# Altium project B001AA.PrjPcb (part 2 of 3)

## Sheet Buzzer.SchDoc: Piezzo Buzzer & Audio Amplifier
size 292 x 193 mm; DocumentNumber: 25; SheetNumber: 18; SheetTotal: 28
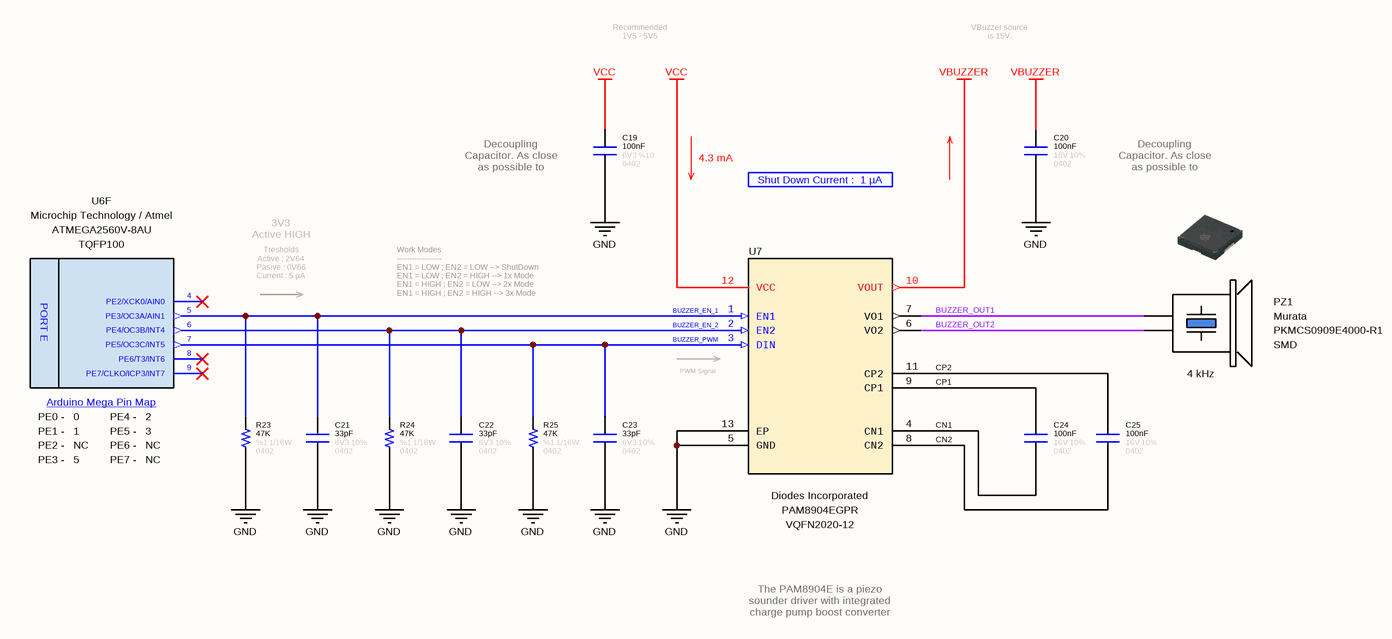
[diagram p13: Buzzer.SchDoc]

### Parts
C19  value 100nF  Tolerance: %10  Voltage: 6V3  Case: 0402  [CAPACITOR_0402]  (hidden comment: Capacitor - 100nF [0402] (Ceramic))
C20  value 100nF  Tolerance: 10%  Case: 0402  Voltage: 16V  [CAPACITOR_0402]  (hidden comment: Capacitor - 100nF [0402] (Ceramic))
C21  value 33pF  Tolerance: 10%  Case: 0402  Voltage: 6V3  [CAPACITOR_0402]  (hidden comment: Capacitor - 33pF [0402] (Ceramic))
C22  value 33pF  Tolerance: 10%  Case: 0402  Voltage: 6V3  [CAPACITOR_0402]  (hidden comment: Capacitor - 33pF [0402] (Ceramic))
C23  value 33pF  Tolerance: 10%  Case: 0402  Voltage: 6V3  [CAPACITOR_0402]  (hidden comment: Capacitor - 33pF [0402] (Ceramic))
C24  value 100nF  Tolerance: 10%  Case: 0402  Voltage: 16V  [CAPACITOR_0402]  (hidden comment: Capacitor - 100nF [0402] (Ceramic))
C25  value 100nF  Tolerance: 10%  Case: 0402  Voltage: 16V  [CAPACITOR_0402]  (hidden comment: Capacitor - 100nF [0402] (Ceramic))
PZ1  Manufacturer Name: Murata  Case: SMD  Frequency: 4 kHz  [Murata - Buzzer]  (hidden comment: PKMCS0909E4000-R1)
R23  value 47K  Tolerance: %1  Case: 0402  Power: 1/16W  [RESISTOR_0402]  (hidden comment: 47K - 0402 - %1 - 1/16W)
R24  value 47K  Tolerance: %1  Case: 0402  Power: 1/16W  [RESISTOR_0402]  (hidden comment: 47K - 0402 - %1 - 1/16W)
R25  value 47K  Tolerance: %1  Case: 0402  Power: 1/16W  [RESISTOR_0402]  (hidden comment: 47K - 0402 - %1 - 1/16W)
U6  Manufacturer Name: Microchip Technology / Atmel  Case: TQFP100  [TQFP-100]  (hidden comment: ATMEGA2560V-8AU)  (part F of 16)
U7  Manufacturer Name: Diodes Incorporated  Case: VQFN2020-12  [U-QFN2020-12]  (hidden comment: PAM8904EGPR)

### Nets
GND: C19.1 C20.1 C21.1 C22.1 C23.1 R23.1 R24.1 R25.1 U7.5(GND) U7.13(EP)
VBUZZER: C20.2 U7.10(VOUT)
VCC: C19.2 U7.12(VCC)
BUZZER_EN_1: C21.2 R23.2 U6.5(PE3/OC3A/AIN1) U7.1(EN1)
BUZZER_EN_2: C22.2 R24.2 U6.6(PE4/OC3B/INT4) U7.2(EN2)
BUZZER_OUT1: PZ1.1(+) U7.7(VO1)
BUZZER_OUT2: PZ1.2(-) U7.6(VO2)
BUZZER_PWM: C23.2 R25.2 U6.7(PE5/OC3C/INT5) U7.3(DIN)
CN1: C24.1 U7.4(CN1)
CN2: C25.1 U7.8(CN2)
CP1: C24.2 U7.9(CP1)
CP2: C25.2 U7.11(CP2)

Not connected (* = marked no-connect by the designer): U6 4(PE2/XCK0/AIN0)* 8(PE6/T3/INT6)* 9(PE7/CLKO/ICP3/INT7)*

### Notes on the sheet
- Recommended 1V5 - 5V5
- VBuzzer source is 15V.
- (near C19) Decoupling Capacitor. As close as possible to PAM8904 pin-12.
- 4.3 mA
- Shut Down Current :  1 µA
- Decoupling Capacitor. As close as possible to PAM8904 pin-10.
- 3V3
  Active HIGH
- Tresholds
  Active : 2V64
  Pasive : 0V66
  Current : 5 µA
- Work Modes
  ------------------
  EN1 = LOW ; EN2 = LOW --> ShutDown
  EN1 = LOW ; EN2 = HIGH --> 1x Mode
  EN1 = HIGH ; EN2 = LOW --> 2x Mode
  EN1 = HIGH ; EN2 = HIGH --> 3x Mode
- (near U7) PWM Signal
- The PAM8904E is a piezo sounder driver with integrated charge pump boost converter
- © 2021 All rights reserved.
  This document may not, in whole or in part, be copied, photocopied, reproduced, translated or converted to any electronic or machine readable from without prior written permission of Mehmet Günce Akkoyun.
  Engineer contact : akkoyun@me.com
- Property of
- Engineer :
- Date :
- Size :
- A4
- Time :
- Project :
- Page :
- /
- Customer :
- Product ID :
- Module ID :
- Version :
- File :
- Revision :
- (in symbol IC - AtMega2560V-8AU, part F) PORT E; Arduino Mega Pin Map; PE0 -; 0; PE4 -; PE1 -; PE5 -; PE2 -; NC; PE6 -; PE3 -; PE7 -

### Library data of the parts
C19 = Capacitor - 100nF [0402-6V3]: as C8 on sheet FOTA Microcontroller Power Switch; ComponentLink1Description: Mouser; ComponentLink1URL: https://www.mouser.com.tr/ProductDetail/AVX/04026D104KAT4A?qs=sGAEpiMZZMs0AnBnWHyRQPg4iYkCw7IMED%2F4kpqgf7w%3D; ComponentLink2Description: DataSheet; ComponentLink2URL: https://www.mouser.com.tr/datasheet/2/40/cx5r-776519.pdf
C20 C24 C25 = Capacitor - 100nF [0402-16V]: Multilayer Ceramic Capacitors - SMD - 16V 100nF X7R 0402 10%; Manufacturer Name: AVX; Manufacturer Part Number: 0402YC104KAT2A
C21-C23 = Capacitor - 33pF [0402-6V3]: as C72 on sheet Port L Output Port; ComponentLink1Description: DataSheet; ComponentLink1URL: https://api.kemet.com/component-edge/download/datasheet/C0402C330J9RACAUTO.pdf; ComponentLink2Description: Mouser; ComponentLink2URL: https://www.mouser.com/Search/Refine.aspx?Keyword=80-C0402C330J9RAUTO
PZ1 = Buzzer - PKMCS0909E4000-R1: MURATA - PKMCS0909E4000-R1 - Transducer, Piezo, Sounder, Sounder, -12.5 VDC, 12.5 VDC, 65 dB; Sound Pressure Level: 65 dBA; Voltage Rating: 12.5 V; Product Type: Piezo Buzzers; RoHS: Yes; Manufacturer Part Number: PKMCS0909E4000-R1
R23-R25 = Resistor - 47K [0402]: as R8 on sheet FOTA LED Driver; ComponentLink1Description: DataSheet; ComponentLink1URL: https://www.mouser.com.tr/datasheet/2/427/dcrcwe3-1762152.pdf; ComponentLink2Description: Mouser; ComponentLink2URL: https://www.mouser.com.tr/ProductDetail/Vishay-Dale/CRCW040247K0FKED?qs=sGAEpiMZZMu61qfTUdNhG2DpbjADlD3GL%252B3h1elTxqU%3D
U6 = IC - AtMega2560V-8AU: as U6 on sheet Port L Output Port; Maximum Operating Temperature: + 85 C; Product Type: MicroControllers; Minimum Operating Temperature: - 40 C; Manufacturer Part Number: ATMEGA2560V-8AU
U7 = IC - PAM8904: 27VPP Piezo Sounder Driver, 1.5 to 5.5V, 0.22mA; Operating Supply Current: 7.9 mA; Supply Voltage - Min: 1.5 V; RoHS: Yes; Maximum Operating Temperature: + 85 C; Minimum Operating Temperature: - 40 C; Product Type: Audio Amplifiers; Supply Voltage - Max: 5.5 V; Manufacturer Part Number: PAM8904EGPR

## Sheet Master MicroController LED Driver.SchDoc: Master MicroController LED Driver
size 292 x 193 mm; SheetNumber: 19; SheetTotal: 28
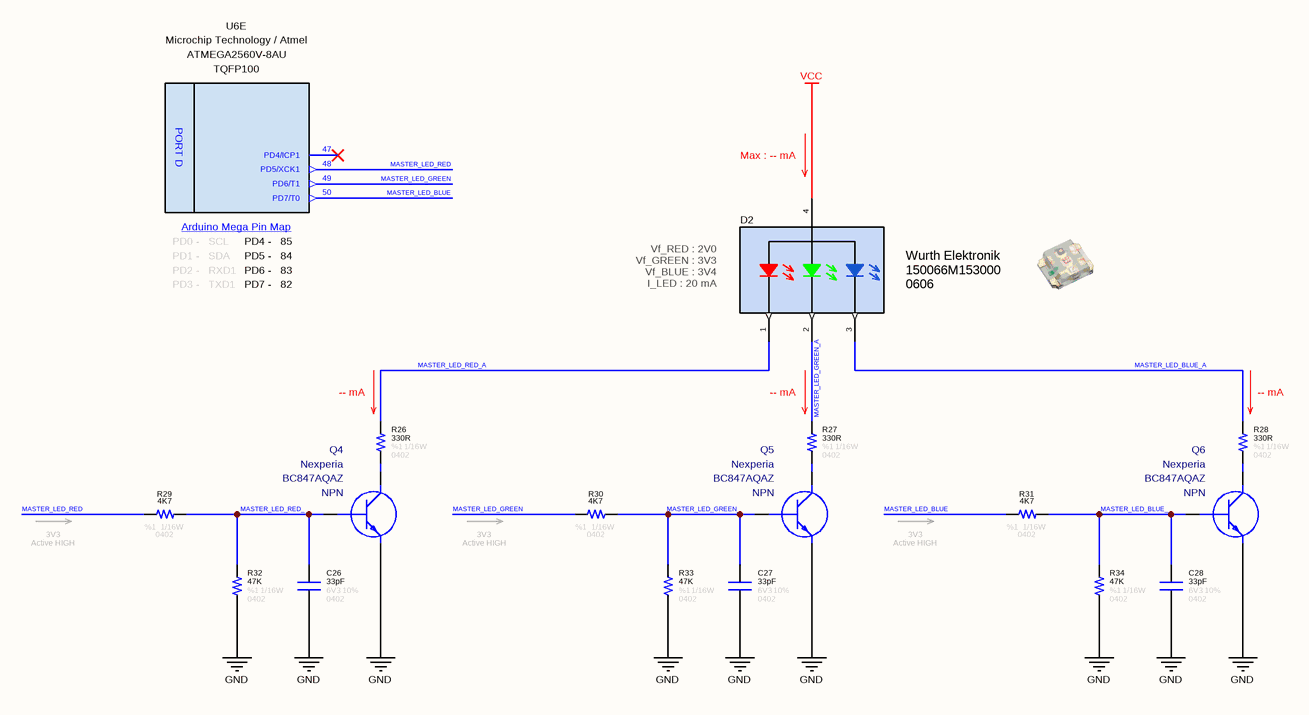
[diagram p14: Master MicroController LED Driver.SchDoc]

### Parts
C26  value 33pF  Tolerance: 10%  Case: 0402  Voltage: 6V3  [CAPACITOR_0402]  (hidden comment: Capacitor - 33pF [0402] (Ceramic))
C27  value 33pF  Tolerance: 10%  Case: 0402  Voltage: 6V3  [CAPACITOR_0402]  (hidden comment: Capacitor - 33pF [0402] (Ceramic))
C28  value 33pF  Tolerance: 10%  Case: 0402  Voltage: 6V3  [CAPACITOR_0402]  (hidden comment: Capacitor - 33pF [0402] (Ceramic))
D2  Manufacturer Name: Wurth Elektronik  Case: 0606  [Wurth_0606]  (hidden comment: 150066M153000)
Q4  Manufacturer Name: Nexperia  Polarity: NPN  [SOT1215]  (hidden comment: BC847AQAZ)
Q5  Manufacturer Name: Nexperia  Polarity: NPN  [SOT1215]  (hidden comment: BC847AQAZ)
Q6  Manufacturer Name: Nexperia  Polarity: NPN  [SOT1215]  (hidden comment: BC847AQAZ)
R26  value 330R  Case: 0402  Tolerance: %1  Power: 1/16W  [RESISTOR_0402]  (hidden comment: 330R - 0402 - %1 - 1/16W)
R27  value 330R  Case: 0402  Tolerance: %1  Power: 1/16W  [RESISTOR_0402]  (hidden comment: 330R - 0402 - %1 - 1/16W)
R28  value 330R  Case: 0402  Tolerance: %1  Power: 1/16W  [RESISTOR_0402]  (hidden comment: 330R - 0402 - %1 - 1/16W)
R29  value 4K7  Tolerance: %1  Case: 0402  Power: 1/16W  [RESISTOR_0402]  (hidden comment: 4K7 - 0402 - %1 - 1/16W)
R30  value 4K7  Tolerance: %1  Case: 0402  Power: 1/16W  [RESISTOR_0402]  (hidden comment: 4K7 - 0402 - %1 - 1/16W)
R31  value 4K7  Tolerance: %1  Case: 0402  Power: 1/16W  [RESISTOR_0402]  (hidden comment: 4K7 - 0402 - %1 - 1/16W)
R32  value 47K  Tolerance: %1  Case: 0402  Power: 1/16W  [RESISTOR_0402]  (hidden comment: 47K - 0402 - %1 - 1/16W)
R33  value 47K  Tolerance: %1  Case: 0402  Power: 1/16W  [RESISTOR_0402]  (hidden comment: 47K - 0402 - %1 - 1/16W)
R34  value 47K  Tolerance: %1  Case: 0402  Power: 1/16W  [RESISTOR_0402]  (hidden comment: 47K - 0402 - %1 - 1/16W)
U6  Manufacturer Name: Microchip Technology / Atmel  Case: TQFP100  [TQFP-100]  (hidden comment: ATMEGA2560V-8AU)  (part E of 16)

### Nets
GND: C26.1 C27.1 C28.1 Q4.2(E) Q5.2(E) Q6.2(E) R32.1 R33.1 R34.1
VCC: D2.4
MASTER_LED_BLUE: R31.2 U6.50(PD7/T0)
MASTER_LED_BLUE_: C28.2 Q6.1(B) R31.1 R34.2
MASTER_LED_BLUE_A: D2.3 R28.2
MASTER_LED_GREEN: R30.2 U6.49(PD6/T1)
MASTER_LED_GREEN_: C27.2 Q5.1(B) R30.1 R33.2
MASTER_LED_GREEN_A: D2.2 R27.2
MASTER_LED_RED: R29.2 U6.48(PD5/XCK1)
MASTER_LED_RED_: C26.2 Q4.1(B) R29.1 R32.2
MASTER_LED_RED_A: D2.1 R26.2
NetQ4_3: Q4.3(C) R26.1
NetQ5_3: Q5.3(C) R27.1
NetQ6_3: Q6.3(C) R28.1

Not connected (* = marked no-connect by the designer): U6 47(PD4/ICP1)*

### Notes on the sheet
- Max : -- mA
- (near D2) Vf_RED : 2V0
  Vf_GREEN : 3V3
  Vf_BLUE : 3V4
  I_LED : 20 mA
- (near R26) -- mA
- (near R27) -- mA
- (near R28) -- mA
- 3V3
  Active HIGH
- © 2021 All rights reserved.
  This document may not, in whole or in part, be copied, photocopied, reproduced, translated or converted to any electronic or machine readable from without prior written permission of Mehmet Günce Akkoyun.
  Engineer contact : akkoyun@me.com
- Property of
- Engineer :
- Date :
- Size :
- A4
- Time :
- Project :
- Page :
- /
- Customer :
- Product ID :
- Module ID :
- Version :
- File :
- Revision :
- (in symbol IC - AtMega2560V-8AU, part E) PORT D; Arduino Mega Pin Map; PD0 -; SCL; PD4 -; PD1 -; SDA; PD5 -; PD2 -; PD6 -; PD3 -; PD7 -

### Library data of the parts
C26-C28 = Capacitor - 33pF [0402-6V3]: as C72 on sheet Port L Output Port; ComponentLink1Description: DataSheet; ComponentLink1URL: https://api.kemet.com/component-edge/download/datasheet/C0402C330J9RACAUTO.pdf; ComponentLink2Description: Mouser; ComponentLink2URL: https://www.mouser.com/Search/Refine.aspx?Keyword=80-C0402C330J9RAUTO
D2 = Diode - LED-RGB: LED RGB DIFFUSED SMD; If - Forward Current: 20 mA; Vf - Forward Voltage: 2 V, 3.3 V; Product Type: LED; Minimum Operating Temperature: - 40 C; Maximum Operating Temperature: + 85 C; ROHS: Yes; Manufacturer Part Number: 150066M153000
Q4-Q6 = Transistor - BC847: Bipolar NPN Transistors; Case: DFN-1010D-3; Manufacturer Part Number: BC847AQAZ
R26-R28 = Resistor - 330R [0402]: as R2 on sheet FOTA LED Driver; ComponentLink1Description: DataSheet; ComponentLink1URL: https://www.mouser.com.tr/datasheet/2/427/dcrcwe3-1762152.pdf; ComponentLink2Description: Mouser; ComponentLink2URL: https://www.mouser.com.tr/ProductDetail/Vishay-Dale/CRCW0402330RFKED?qs=sGAEpiMZZMu61qfTUdNhG2DpbjADlD3GGS6SwBlLi5Q%3D
R29-R31 = Resistor - 4K7 [0402]: Thick Film Resistors - SMD 1/16 W 4.7 KOhm 1%; Manufacturer Name: Vishay; Manufacturer Part Number: CRCW04024K70FKED; ComponentLink1Description: DataSheet; ComponentLink1URL: https://www.mouser.com.tr/datasheet/2/427/dcrcwe3-1762152.pdf; ComponentLink2Description: Mouser; ComponentLink2URL: https://www.mouser.com.tr/ProductDetail/Vishay-Dale/CRCW04024K70FKED?qs=sGAEpiMZZMu61qfTUdNhG7nHf%2F6MTUn3HadIdDQu24Q%3D
R32-R34 = Resistor - 47K [0402]: as R8 on sheet FOTA LED Driver; ComponentLink1Description: DataSheet; ComponentLink1URL: https://www.mouser.com.tr/datasheet/2/427/dcrcwe3-1762152.pdf; ComponentLink2Description: Mouser; ComponentLink2URL: https://www.mouser.com.tr/ProductDetail/Vishay-Dale/CRCW040247K0FKED?qs=sGAEpiMZZMu61qfTUdNhG2DpbjADlD3GL%252B3h1elTxqU%3D
U6 = IC - AtMega2560V-8AU: as U6 on sheet Port L Output Port; Maximum Operating Temperature: + 85 C; Product Type: MicroControllers; Minimum Operating Temperature: - 40 C; Manufacturer Part Number: ATMEGA2560V-8AU

## Sheet I2C Block Diagram.SchDoc: I2C Network Block Diagram
size 292 x 193 mm; SheetNumber: 19; SheetTotal: 27
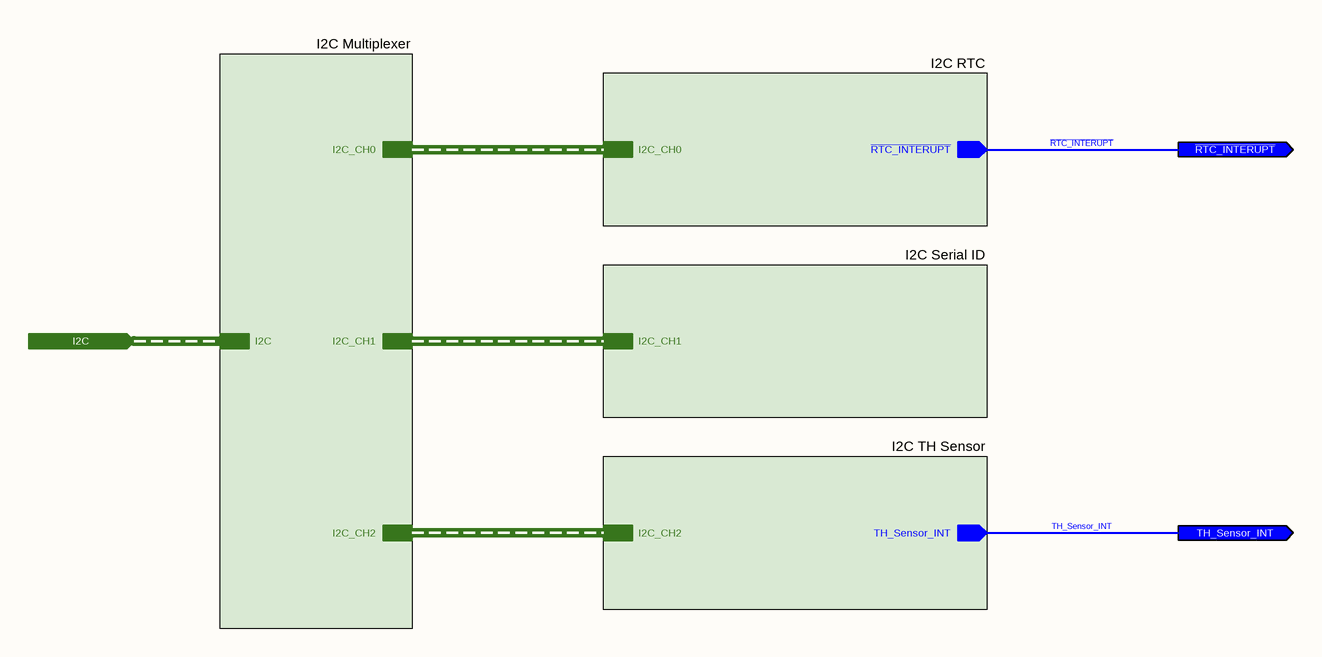
[diagram p15: I2C Block Diagram.SchDoc]

### Sub-sheets
I2C Multiplexer = I2C Multiplexer.SchDoc: I2C (harness I2C), I2C_CH2 (harness I2C_CH2), I2C_CH1 (harness I2C_CH1), I2C_CH0 (harness I2C_CH0)
I2C RTC = I2C Real Time Clock.SchDoc: ~{RTC_INTERUPT} (out), I2C_CH0 (harness I2C_CH0)
I2C Serial ID = I2C Serial ID EEPROM.SchDoc: I2C_CH1 (harness I2C_CH1)
I2C TH Sensor = I2C Temperature Sensor.SchDoc: TH_Sensor_INT (out), I2C_CH2 (harness I2C_CH2)

### Ports
I2C (in, harness I2C), TH_Sensor_INT (out), ~{RTC_INTERUPT} (out)

### Nets
~{RTC_INTERUPT}: port ~{RTC_INTERUPT}, sheet I2C RTC/~{RTC_INTERUPT}
TH_Sensor_INT: port TH_Sensor_INT, sheet I2C TH Sensor/TH_Sensor_INT

### Buses and harness runs
harness port I2C = sheet I2C Multiplexer/I2C
harness sheet I2C Multiplexer/I2C_CH0 = sheet I2C RTC/I2C_CH0
harness sheet I2C Multiplexer/I2C_CH1 = sheet I2C Serial ID/I2C_CH1
harness sheet I2C Multiplexer/I2C_CH2 = sheet I2C TH Sensor/I2C_CH2

### Notes on the sheet
- © 2021 All rights reserved.
  This document may not, in whole or in part, be copied, photocopied, reproduced, translated or converted to any electronic or machine readable from without prior written permission of Mehmet Günce Akkoyun.
  Engineer contact : akkoyun@me.com
- Property of
- Engineer :
- Date :
- Size :
- A4
- Time :
- Project :
- Page :
- /
- Customer :
- Product ID :
- Module ID :
- Version :
- File :
- Revision :

## Sheet I2C Multiplexer.SchDoc: I2C Master Multiplexer
size 292 x 193 mm; DocumentNumber: 35; SheetNumber: 12; SheetTotal: 28
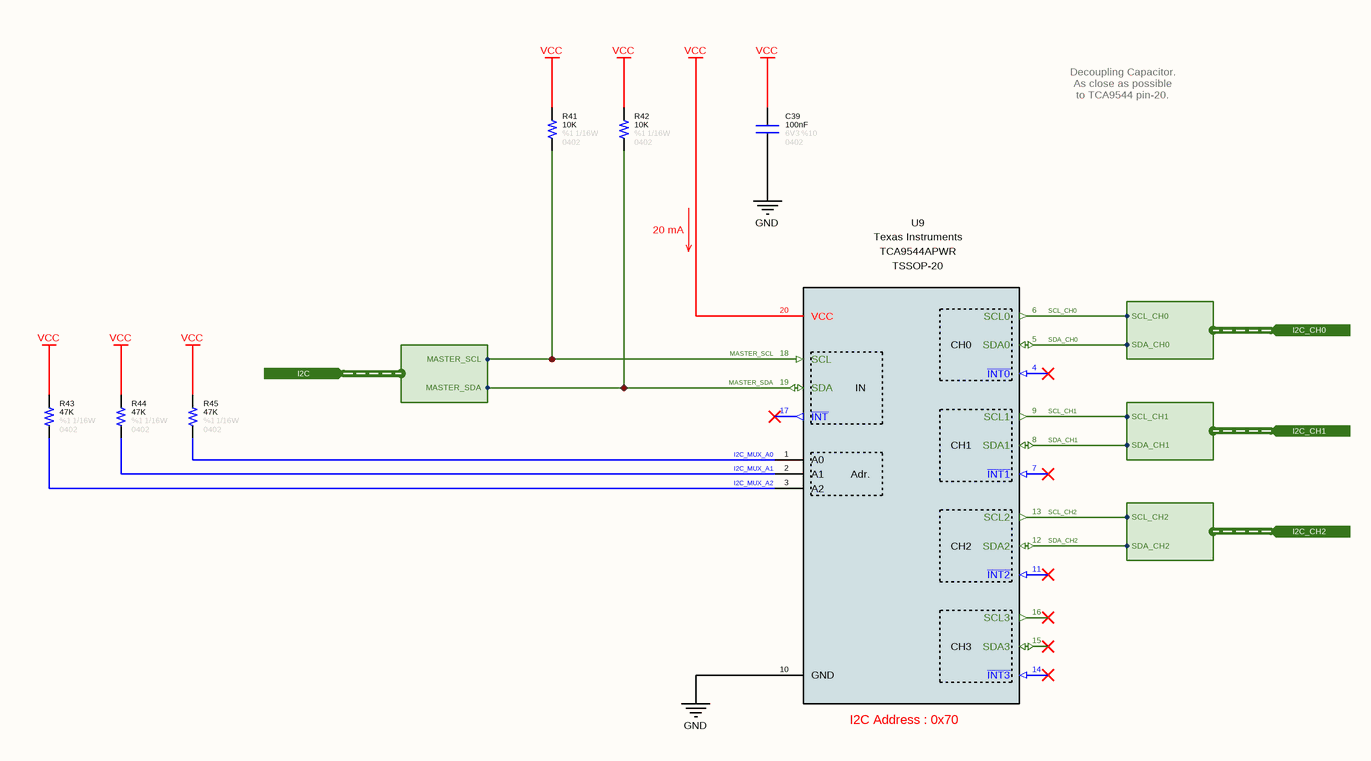
[diagram p16: I2C Multiplexer.SchDoc]

### Parts
C39  value 100nF  Tolerance: %10  Voltage: 6V3  Case: 0402  [CAPACITOR_0402]  (hidden comment: Capacitor - 100nF [0402] (Ceramic))
R41  value 10K  Tolerance: %1  Case: 0402  Power: 1/16W  [RESISTOR_0402]  (hidden comment: 10K - 0402 - %1 - 1/16W)
R42  value 10K  Tolerance: %1  Case: 0402  Power: 1/16W  [RESISTOR_0402]  (hidden comment: 10K - 0402 - %1 - 1/16W)
R43  value 47K  Tolerance: %1  Case: 0402  Power: 1/16W  [RESISTOR_0402]  (hidden comment: 47K - 0402 - %1 - 1/16W)
R44  value 47K  Tolerance: %1  Case: 0402  Power: 1/16W  [RESISTOR_0402]  (hidden comment: 47K - 0402 - %1 - 1/16W)
R45  value 47K  Tolerance: %1  Case: 0402  Power: 1/16W  [RESISTOR_0402]  (hidden comment: 47K - 0402 - %1 - 1/16W)
U9  Manufacturer Name: Texas Instruments  Manufacturer Part Number: TCA9544APWR  [TSSOP-20]  (hidden comment: TCA9548APWR)

### Ports
I2C (in, harness I2C), I2C_CH0 (in, harness I2C_CH0), I2C_CH1 (in, harness I2C_CH1), I2C_CH2 (in, harness I2C_CH2)

### Harnesses
I2C: MASTER_SDA, MASTER_SCL
I2C_CH0: SDA_CH0, SCL_CH0
I2C_CH1: SDA_CH1, SCL_CH1
I2C_CH2: SDA_CH2, SCL_CH2

### Nets
GND: C39.1 U9.10(GND)
VCC: C39.2 R41.2 R42.2 R43.2 R44.2 R45.2 U9.20(VCC)
I2C_MUX_A0: R45.1 U9.1(A0)
I2C_MUX_A1: R44.1 U9.2(A1)
I2C_MUX_A2: R43.1 U9.3(A2)
MASTER_SCL: R41.1 U9.18(SCL) ; port I2C.MASTER_SCL
MASTER_SDA: R42.1 U9.19(SDA) ; port I2C.MASTER_SDA
SCL_CH0: U9.6(SCL0) ; port I2C_CH0.SCL_CH0
SCL_CH1: U9.9(SCL1) ; port I2C_CH1.SCL_CH1
SCL_CH2: U9.13(SCL2) ; port I2C_CH2.SCL_CH2
SDA_CH0: U9.5(SDA0) ; port I2C_CH0.SDA_CH0
SDA_CH1: U9.8(SDA1) ; port I2C_CH1.SDA_CH1
SDA_CH2: U9.12(SDA2) ; port I2C_CH2.SDA_CH2

Not connected (* = marked no-connect by the designer): U9 4(~{INT0})* 7(~{INT1})* 11(~{INT2})* 14(~{INT3})* 15(SDA3)* 16(SCL3)* 17(~{INT})*

### Notes on the sheet
- Decoupling Capacitor. As close as possible to TCA9544 pin-20.
- 20 mA
- (near U9) I2C Address : 0x70
- © 2021 All rights reserved.
  This document may not, in whole or in part, be copied, photocopied, reproduced, translated or converted to any electronic or machine readable from without prior written permission of Mehmet Günce Akkoyun.
  Engineer contact : akkoyun@me.com
- Property of
- Engineer :
- Date :
- Size :
- A4
- Time :
- Project :
- Page :
- /
- Customer :
- Product ID :
- Module ID :
- Version :
- File :
- Revision :
- (in symbol IC - TCA9544A) CH0; IN; CH1; Adr.; CH2; CH3

### Library data of the parts
C39 = Capacitor - 100nF [0402-6V3]: as C8 on sheet FOTA Microcontroller Power Switch; ComponentLink1Description: Mouser; ComponentLink1URL: https://www.mouser.com.tr/ProductDetail/AVX/04026D104KAT4A?qs=sGAEpiMZZMs0AnBnWHyRQPg4iYkCw7IMED%2F4kpqgf7w%3D; ComponentLink2Description: DataSheet; ComponentLink2URL: https://www.mouser.com.tr/datasheet/2/40/cx5r-776519.pdf
R41 R42 = Resistor - 10K [0402]: as R1 on sheet FOTA Micro Controller; ComponentLink1Description: DataSheet; ComponentLink1URL: https://www.mouser.com.tr/datasheet/2/427/dcrcwe3-1762152.pdf; ComponentLink2Description: Mouser; ComponentLink2URL: https://www.mouser.com.tr/ProductDetail/Vishay-Dale/CRCW040210K0FKED?qs=sGAEpiMZZMu61qfTUdNhG2DpbjADlD3GcalbOv9utCY%3D
R43-R45 = Resistor - 47K [0402]: as R8 on sheet FOTA LED Driver; ComponentLink1Description: DataSheet; ComponentLink1URL: https://www.mouser.com.tr/datasheet/2/427/dcrcwe3-1762152.pdf; ComponentLink2Description: Mouser; ComponentLink2URL: https://www.mouser.com.tr/ProductDetail/Vishay-Dale/CRCW040247K0FKED?qs=sGAEpiMZZMu61qfTUdNhG2DpbjADlD3GL%252B3h1elTxqU%3D
U9 = IC - TCA9544A: TEXAS INSTRUMENTS - TCA9548APWR - I2C SWITCH W/ RESET, 8-CH, TSSOP-24; Channel: 4; Maximum Operating Temperature: + 85 C; Minimum Operating Temperature: - 40 C; Product Type: Switch ICs; Case: TSSOP-20

## Sheet I2C Real Time Clock.SchDoc: I2C Real Time Clock
size 292 x 193 mm; DocumentNumber: 38; SheetNumber: 13; SheetTotal: 28
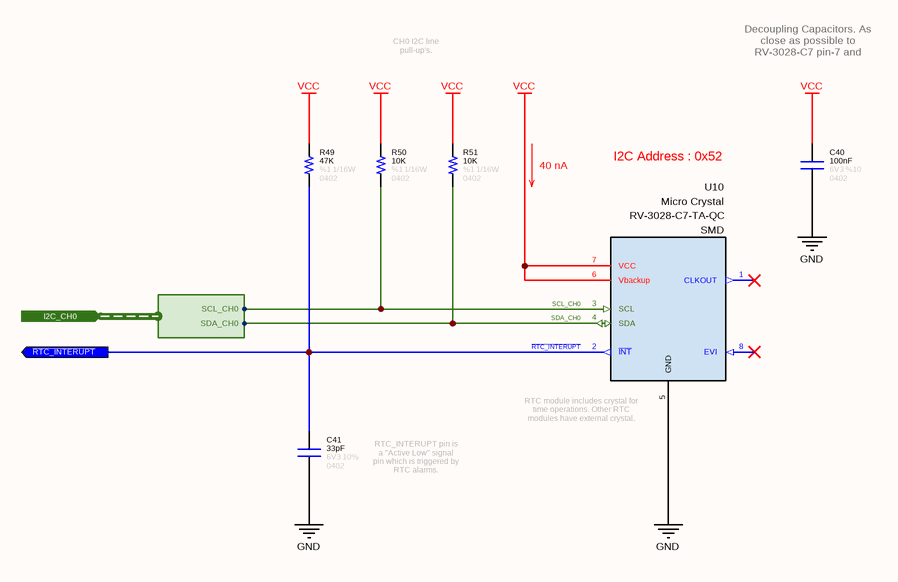
[diagram p17: I2C Real Time Clock.SchDoc]

### Parts
C40  value 100nF  Tolerance: %10  Voltage: 6V3  Case: 0402  [CAPACITOR_0402]  (hidden comment: Capacitor - 100nF [0402] (Ceramic))
C41  value 33pF  Tolerance: 10%  Case: 0402  Voltage: 6V3  [CAPACITOR_0402]  (hidden comment: Capacitor - 33pF [0402] (Ceramic))
R49  value 47K  Tolerance: %1  Case: 0402  Power: 1/16W  [RESISTOR_0402]  (hidden comment: 47K - 0402 - %1 - 1/16W)
R50  value 10K  Tolerance: %1  Case: 0402  Power: 1/16W  [RESISTOR_0402]  (hidden comment: 10K - 0402 - %1 - 1/16W)
R51  value 10K  Tolerance: %1  Case: 0402  Power: 1/16W  [RESISTOR_0402]  (hidden comment: 10K - 0402 - %1 - 1/16W)
U10  Manufacturer Name: Micro Crystal  Manufacturer Part Number: RV-3028-C7-TA-QC  Case: SMD  [RV-3028-C7]  (hidden comment: RV-3028-C7 32.768KHZ 1PPM TA QC)

### Ports
I2C_CH0 (in, harness I2C_CH0), ~{RTC_INTERUPT} (out)

### Harnesses
I2C_CH0: SDA_CH0, SCL_CH0

### Nets
GND: C40.1 C41.1 U10.5(GND)
VCC: C40.2 R49.2 R50.2 R51.2 U10.6(Vbackup) U10.7(VCC)
~{RTC_INTERUPT}: C41.2 R49.1 U10.2(~{INT}) ; port ~{RTC_INTERUPT}
SCL_CH0: R50.1 U10.3(SCL) ; port I2C_CH0.SCL_CH0
SDA_CH0: R51.1 U10.4(SDA) ; port I2C_CH0.SDA_CH0

Not connected (* = marked no-connect by the designer): U10 1(CLKOUT)* 8(EVI)*

### Notes on the sheet
- CH0 I2C line pull-up's.
- Decoupling Capacitors. As close as possible to RV-3028-C7 pin-7 and pin-6.
- 40 nA
- I2C Address : 0x52
- RTC_INTERUPT pin is a "Active Low" signal pin which is triggered by RTC alarms.
- (near U10) RTC module includes crystal for time operations. Other RTC modules have external crystal.
- © 2021 All rights reserved.
  This document may not, in whole or in part, be copied, photocopied, reproduced, translated or converted to any electronic or machine readable from without prior written permission of Mehmet Günce Akkoyun.
  Engineer contact : akkoyun@me.com
- Property of
- Engineer :
- Date :
- Size :
- A4
- Time :
- Project :
- Page :
- /
- Customer :
- Product ID :
- Module ID :
- Version :
- File :
- Revision :

### Library data of the parts
C40 = Capacitor - 100nF [0402-6V3]: as C8 on sheet FOTA Microcontroller Power Switch; ComponentLink1Description: Mouser; ComponentLink1URL: https://www.mouser.com.tr/ProductDetail/AVX/04026D104KAT4A?qs=sGAEpiMZZMs0AnBnWHyRQPg4iYkCw7IMED%2F4kpqgf7w%3D; ComponentLink2Description: DataSheet; ComponentLink2URL: https://www.mouser.com.tr/datasheet/2/40/cx5r-776519.pdf
C41 = Capacitor - 33pF [0402-6V3]: as C72 on sheet Port L Output Port; ComponentLink1Description: DataSheet; ComponentLink1URL: https://api.kemet.com/component-edge/download/datasheet/C0402C330J9RACAUTO.pdf; ComponentLink2Description: Mouser; ComponentLink2URL: https://www.mouser.com/Search/Refine.aspx?Keyword=80-C0402C330J9RAUTO
R49 = Resistor - 47K [0402]: as R8 on sheet FOTA LED Driver; ComponentLink1Description: DataSheet; ComponentLink1URL: https://www.mouser.com.tr/datasheet/2/427/dcrcwe3-1762152.pdf; ComponentLink2Description: Mouser; ComponentLink2URL: https://www.mouser.com.tr/ProductDetail/Vishay-Dale/CRCW040247K0FKED?qs=sGAEpiMZZMu61qfTUdNhG2DpbjADlD3GL%252B3h1elTxqU%3D
R50 R51 = Resistor - 10K [0402]: as R1 on sheet FOTA Micro Controller; ComponentLink1Description: DataSheet; ComponentLink1URL: https://www.mouser.com.tr/datasheet/2/427/dcrcwe3-1762152.pdf; ComponentLink2Description: Mouser; ComponentLink2URL: https://www.mouser.com.tr/ProductDetail/Vishay-Dale/CRCW040210K0FKED?qs=sGAEpiMZZMu61qfTUdNhG2DpbjADlD3GcalbOv9utCY%3D
U10 = IC - RV-3028-C7: IC Rtc Clk/calendar I2C 8-SMT; Supply Voltage - Max: 5.5 V; Supply Voltage - Min: 1.2 V; Product Type: Real Time Clocks; Minimum Operating Temperature: - 40 C; Maximum Operating Temperature: + 85 C

## Sheet I2C Serial ID EEPROM.SchDoc: I2C Serial ID EEprom
size 292 x 193 mm; DocumentNumber: 36; SheetNumber: 14; SheetTotal: 28
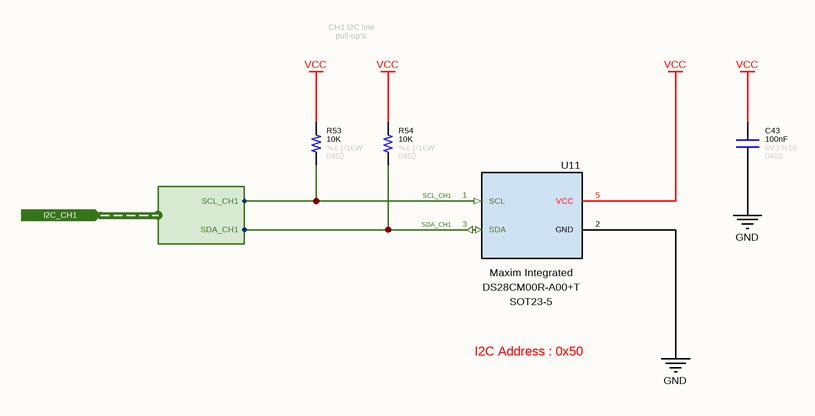
[diagram p18: I2C Serial ID EEPROM.SchDoc]

### Parts
C43  value 100nF  Tolerance: %10  Voltage: 6V3  Case: 0402  [CAPACITOR_0402]  (hidden comment: Capacitor - 100nF [0402] (Ceramic))
R53  value 10K  Tolerance: %1  Case: 0402  Power: 1/16W  [RESISTOR_0402]  (hidden comment: 10K - 0402 - %1 - 1/16W)
R54  value 10K  Tolerance: %1  Case: 0402  Power: 1/16W  [RESISTOR_0402]  (hidden comment: 10K - 0402 - %1 - 1/16W)
U11  Manufacturer Name: Maxim Integrated  Case: SOT23-5  [SOT-23-5]  (hidden comment: DS28CM00R-A00+T)

### Ports
I2C_CH1 (in, harness I2C_CH1)

### Harnesses
I2C_CH1: SDA_CH1, SCL_CH1

### Nets
GND: C43.1 U11.2(GND)
VCC: C43.2 R53.2 R54.2 U11.5(VCC)
SCL_CH1: R53.1 U11.1(SCL) ; port I2C_CH1.SCL_CH1
SDA_CH1: R54.1 U11.3(SDA) ; port I2C_CH1.SDA_CH1

Not connected (* = marked no-connect by the designer): U11 4(NC)

### Notes on the sheet
- CH1 I2C line pull-up's.
- I2C Address : 0x50
- © 2021 All rights reserved.
  This document may not, in whole or in part, be copied, photocopied, reproduced, translated or converted to any electronic or machine readable from without prior written permission of Mehmet Günce Akkoyun.
  Engineer contact : akkoyun@me.com
- Property of
- Engineer :
- Date :
- Size :
- A4
- Time :
- Project :
- Page :
- /
- Customer :
- Product ID :
- Module ID :
- Version :
- File :
- Revision :

### Library data of the parts
C43 = Capacitor - 100nF [0402-6V3]: as C8 on sheet FOTA Microcontroller Power Switch; ComponentLink1Description: Mouser; ComponentLink1URL: https://www.mouser.com.tr/ProductDetail/AVX/04026D104KAT4A?qs=sGAEpiMZZMs0AnBnWHyRQPg4iYkCw7IMED%2F4kpqgf7w%3D; ComponentLink2Description: DataSheet; ComponentLink2URL: https://www.mouser.com.tr/datasheet/2/40/cx5r-776519.pdf
R53 R54 = Resistor - 10K [0402]: as R1 on sheet FOTA Micro Controller; ComponentLink1Description: DataSheet; ComponentLink1URL: https://www.mouser.com.tr/datasheet/2/427/dcrcwe3-1762152.pdf; ComponentLink2Description: Mouser; ComponentLink2URL: https://www.mouser.com.tr/ProductDetail/Vishay-Dale/CRCW040210K0FKED?qs=sGAEpiMZZMu61qfTUdNhG2DpbjADlD3GcalbOv9utCY%3D
U11 = IC - DS28C: Security ICs / Authentication ICs I C/SMBus Silicon Serial Number; Data Bus Width: 64 bit; RoHS: Yes; Product Type: Security ICs; Manufacturer Part Number: DS28CM00R-A00+T

## Sheet I2C Temperature Sensor.SchDoc: I2C Temperature Sensor
size 292 x 193 mm; DocumentNumber: 39; SheetNumber: 15; SheetTotal: 28
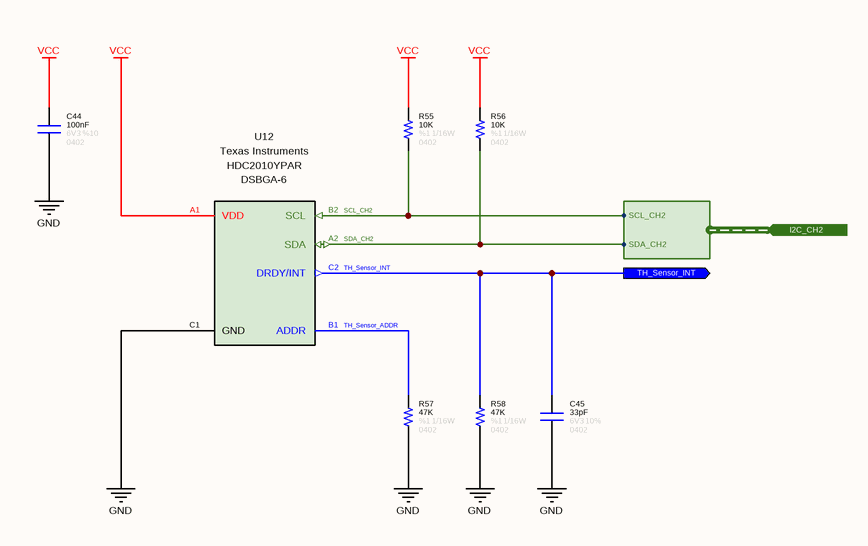
[diagram p19: I2C Temperature Sensor.SchDoc]

### Parts
C44  value 100nF  Tolerance: %10  Voltage: 6V3  Case: 0402  [CAPACITOR_0402]  (hidden comment: Capacitor - 100nF [0402] (Ceramic))
C45  value 33pF  Tolerance: 10%  Case: 0402  Voltage: 6V3  [CAPACITOR_0402]  (hidden comment: Capacitor - 33pF [0402] (Ceramic))
R55  value 10K  Tolerance: %1  Case: 0402  Power: 1/16W  [RESISTOR_0402]  (hidden comment: 10K - 0402 - %1 - 1/16W)
R56  value 10K  Tolerance: %1  Case: 0402  Power: 1/16W  [RESISTOR_0402]  (hidden comment: 10K - 0402 - %1 - 1/16W)
R57  value 47K  Tolerance: %1  Case: 0402  Power: 1/16W  [RESISTOR_0402]  (hidden comment: 47K - 0402 - %1 - 1/16W)
R58  value 47K  Tolerance: %1  Case: 0402  Power: 1/16W  [RESISTOR_0402]  (hidden comment: 47K - 0402 - %1 - 1/16W)
U12  Manufacturer Name: Texas Instruments  Case: DSBGA-6  [HDC2010]  (hidden comment: HDC2010YPAR)

### Ports
I2C_CH2 (in, harness I2C_CH2), TH_Sensor_INT (out)

### Harnesses
I2C_CH2: SDA_CH2, SCL_CH2

### Nets
GND: C44.1 C45.1 R57.1 R58.1 U12.C1(GND)
VCC: C44.2 R55.2 R56.2 U12.A1(VDD)
SCL_CH2: R55.1 U12.B2(SCL) ; port I2C_CH2.SCL_CH2
SDA_CH2: R56.1 U12.A2(SDA) ; port I2C_CH2.SDA_CH2
TH_Sensor_ADDR: R57.2 U12.B1(ADDR)
TH_Sensor_INT: C45.2 R58.2 U12.C2(DRDY/INT) ; port TH_Sensor_INT

### Notes on the sheet
- © 2021 All rights reserved.
  This document may not, in whole or in part, be copied, photocopied, reproduced, translated or converted to any electronic or machine readable from without prior written permission of Mehmet Günce Akkoyun.
  Engineer contact : akkoyun@me.com
- Property of
- Engineer :
- Date :
- Size :
- A4
- Time :
- Project :
- Page :
- /
- Customer :
- Product ID :
- Module ID :
- Version :
- File :
- Revision :

### Library data of the parts
C44 = Capacitor - 100nF [0402-6V3]: Capacitor - 100nF [0402-6V3] (Ceramic); Manufacturer Name: AVX; Manufacturer Part Number: 04026D104KAT4A; ComponentLink1Description: Mouser; ComponentLink1URL: https://www.mouser.com.tr/ProductDetail/AVX/04026D104KAT4A?qs=sGAEpiMZZMs0AnBnWHyRQPg4iYkCw7IMED%2F4kpqgf7w%3D; ComponentLink2Description: DataSheet; ComponentLink2URL: https://www.mouser.com.tr/datasheet/2/40/cx5r-776519.pdf
C45 = Capacitor - 33pF [0402-6V3]: Manufacturer Name: Kemet; Manufacturer Part Number: C0402C330J9RACAUTO; ComponentLink1Description: DataSheet; ComponentLink1URL: https://api.kemet.com/component-edge/download/datasheet/C0402C330J9RACAUTO.pdf; ComponentLink2Description: Mouser; ComponentLink2URL: https://www.mouser.com/Search/Refine.aspx?Keyword=80-C0402C330J9RAUTO
R55 R56 = Resistor - 10K [0402]: Thick Film Resistors - SMD 1/16 W 10 KOhm 1%; Manufacturer Name: Vishay; Manufacturer Part Number: CRCW040210K0FKED; ComponentLink1Description: DataSheet; ComponentLink1URL: https://www.mouser.com.tr/datasheet/2/427/dcrcwe3-1762152.pdf; ComponentLink2Description: Mouser; ComponentLink2URL: https://www.mouser.com.tr/ProductDetail/Vishay-Dale/CRCW040210K0FKED?qs=sGAEpiMZZMu61qfTUdNhG2DpbjADlD3GcalbOv9utCY%3D
R57 R58 = Resistor - 47K [0402]: Thick Film Resistors - SMD 1/16 W 47 KOhm 1%; Manufacturer Name: Vishay; Manufacturer Part Number: CRCW040247K0FKED; ComponentLink1Description: DataSheet; ComponentLink1URL: https://www.mouser.com.tr/datasheet/2/427/dcrcwe3-1762152.pdf; ComponentLink2Description: Mouser; ComponentLink2URL: https://www.mouser.com.tr/ProductDetail/Vishay-Dale/CRCW040247K0FKED?qs=sGAEpiMZZMu61qfTUdNhG2DpbjADlD3GL%252B3h1elTxqU%3D
U12 = IC - HDC2010: GEN 2 HUMIDITY SENSOR; Product Type: T/H Sensor; Maximum Operating Temperature: + 85 C; Minimum Operating Temperature: - 40 C; Manufacturer Part Number: HDC2010YPAR

## Sheet Master Micro Controller Core.SchDoc: Main MicroController Core
size 292 x 193 mm; SheetNumber: 10; SheetTotal: 28
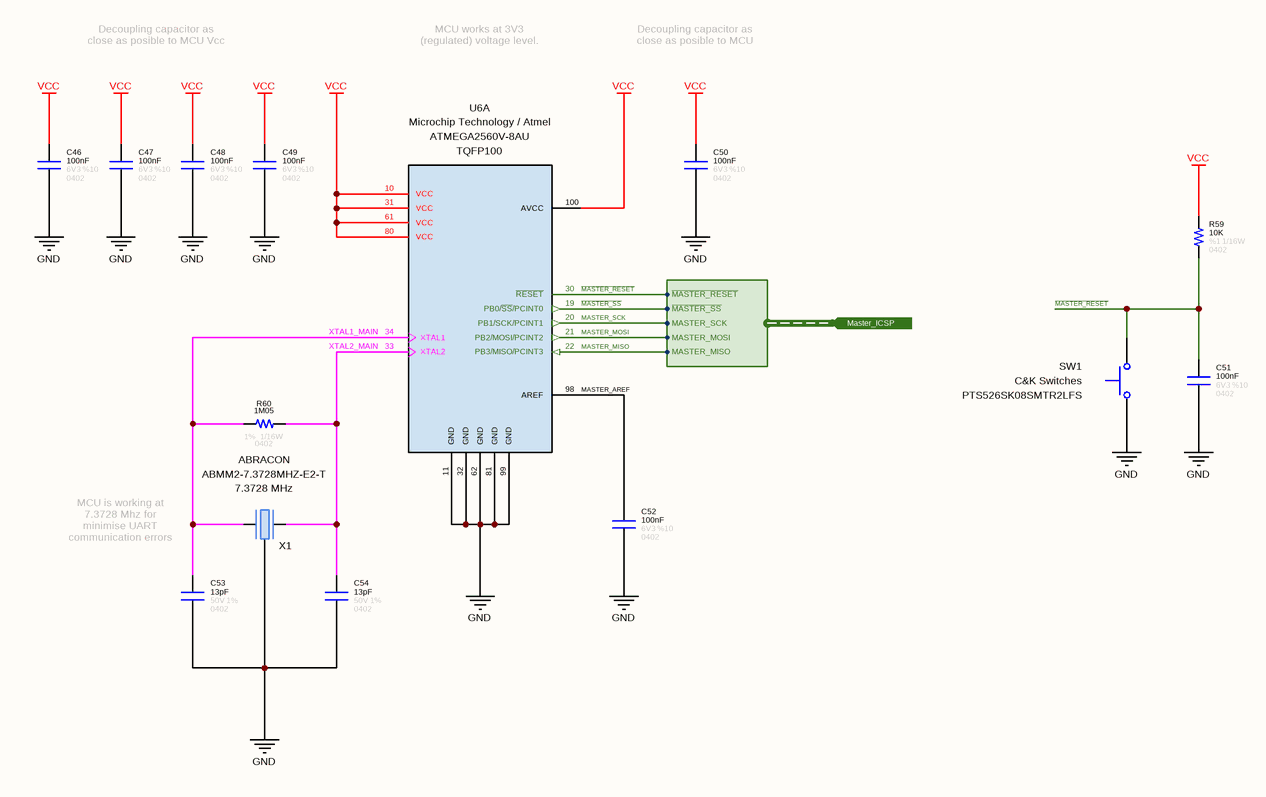
[diagram p20: Master Micro Controller Core.SchDoc]

### Parts
C46  value 100nF  Tolerance: %10  Voltage: 6V3  Case: 0402  [CAPACITOR_0402]  (hidden comment: Capacitor - 100nF [0402] (Ceramic))
C47  value 100nF  Tolerance: %10  Voltage: 6V3  Case: 0402  [CAPACITOR_0402]  (hidden comment: Capacitor - 100nF [0402] (Ceramic))
C48  value 100nF  Tolerance: %10  Voltage: 6V3  Case: 0402  [CAPACITOR_0402]  (hidden comment: Capacitor - 100nF [0402] (Ceramic))
C49  value 100nF  Tolerance: %10  Voltage: 6V3  Case: 0402  [CAPACITOR_0402]  (hidden comment: Capacitor - 100nF [0402] (Ceramic))
C50  value 100nF  Tolerance: %10  Voltage: 6V3  Case: 0402  [CAPACITOR_0402]  (hidden comment: Capacitor - 100nF [0402] (Ceramic))
C51  value 100nF  Tolerance: %10  Voltage: 6V3  Case: 0402  [CAPACITOR_0402]  (hidden comment: Capacitor - 100nF [0402] (Ceramic))
C52  value 100nF  Tolerance: %10  Voltage: 6V3  Case: 0402  [CAPACITOR_0402]  (hidden comment: Capacitor - 100nF [0402] (Ceramic))
C53  value 13pF  Tolerance: 1%  Case: 0402  Voltage: 50V  [CAPACITOR_0402]  (hidden comment: Capacitor - 13pF [0402] (Ceramic))
C54  value 13pF  Tolerance: 1%  Case: 0402  Voltage: 50V  [CAPACITOR_0402]  (hidden comment: Capacitor - 13pF [0402] (Ceramic))
R59  value 10K  Tolerance: %1  Case: 0402  Power: 1/16W  [RESISTOR_0402]  (hidden comment: 10K - 0402 - %1 - 1/16W)
R60  value 1M05  Power: 1/16W  Case: 0402  Tolerance: 1%  [RESISTOR_0402]  (hidden comment: 1M05 - 0402 - %1 - 1/16W)
SW1  Manufacturer Name: C&K Switches  [PTS526_Switch]  (hidden comment: PTS526SK08SMTR2LFS)
U6  Manufacturer Name: Microchip Technology / Atmel  Case: TQFP100  [TQFP-100]  (hidden comment: ATMEGA2560V-8AU)  (part A of 16)
X1  Manufacturer Name: ABRACON  Frequency: 7.3728 MHz  [CRYSTAL - 7.3728 MHz]  (hidden comment: ABMM2-7.3728MHZ-E2-T)

### Ports
Master_ICSP (in, harness Master_ICSP)

### Harnesses
Master_ICSP: MASTER_MOSI, MASTER_MISO, MASTER_SCK, ~{MASTER_RESET}, ~{MASTER_SS}

### Nets
GND: C46.1 C47.1 C48.1 C49.1 C50.1 C51.1 C52.1 C53.1 C54.1 SW1.1(NC) U6.11(GND) U6.32(GND) U6.62(GND) U6.81(GND) U6.99(GND) X1.2(GND)
VCC: C46.2 C47.2 C48.2 C49.2 C50.2 R59.2 U6.10(VCC) U6.31(VCC) U6.61(VCC) U6.80(VCC) U6.100(AVCC)
~{MASTER_RESET}: C51.2 R59.1 SW1.2(COM) U6.30(~{RESET}) ; port Master_ICSP.~{MASTER_RESET}
~{MASTER_SS}: U6.19(PB0/~{SS}/PCINT0) ; port Master_ICSP.~{MASTER_SS}
MASTER_AREF: C52.2 U6.98(AREF)
MASTER_MISO: U6.22(PB3/MISO/PCINT3) ; port Master_ICSP.MASTER_MISO
MASTER_MOSI: U6.21(PB2/MOSI/PCINT2) ; port Master_ICSP.MASTER_MOSI
MASTER_SCK: U6.20(PB1/SCK/PCINT1) ; port Master_ICSP.MASTER_SCK
XTAL1_MAIN: C53.2 R60.1 U6.34(XTAL1) X1.3(OUT/IN)
XTAL2_MAIN: C54.2 R60.2 U6.33(XTAL2) X1.1(IN/OUT)

Not connected (* = marked no-connect by the designer): X1 4(GND)

### Notes on the sheet
- Decoupling capacitor as close as posible to MCU Vcc pins.
- MCU works at 3V3 (regulated) voltage level.
- Decoupling capacitor as close as posible to MCU AVcc pin.
- (near C53) MCU is working at 7.3728 Mhz for minimise UART communication errors (115200bps).
- © 2021 All rights reserved.
  This document may not, in whole or in part, be copied, photocopied, reproduced, translated or converted to any electronic or machine readable from without prior written permission of Mehmet Günce Akkoyun.
  Engineer contact : akkoyun@me.com
- Property of
- Engineer :
- Date :
- Size :
- A4
- Time :
- Project :
- Page :
- /
- Customer :
- Product ID :
- Module ID :
- Version :
- File :
- Revision :

### Library data of the parts
C46-C52 = Capacitor - 100nF [0402-6V3]: as C44 on sheet I2C Temperature Sensor; ComponentLink1Description: Mouser; ComponentLink1URL: https://www.mouser.com.tr/ProductDetail/AVX/04026D104KAT4A?qs=sGAEpiMZZMs0AnBnWHyRQPg4iYkCw7IMED%2F4kpqgf7w%3D; ComponentLink2Description: DataSheet; ComponentLink2URL: https://www.mouser.com.tr/datasheet/2/40/cx5r-776519.pdf
C53 C54 = Capacitor - 13pF [0402-50V]: Multilayer Ceramic Capacitors - SMD - 50V 13pF X5R 0402 1%; Manufacturer Part Number: CBR04C130F5GAC; Manufacturer Name: KEMET
R59 = Resistor - 10K [0402]: as R55 on sheet I2C Temperature Sensor; ComponentLink1Description: DataSheet; ComponentLink1URL: https://www.mouser.com.tr/datasheet/2/427/dcrcwe3-1762152.pdf; ComponentLink2Description: Mouser; ComponentLink2URL: https://www.mouser.com.tr/ProductDetail/Vishay-Dale/CRCW040210K0FKED?qs=sGAEpiMZZMu61qfTUdNhG2DpbjADlD3GcalbOv9utCY%3D
R60 = Resistor - 1M05 [0402]: Thick Film Resistors - SMD 1/16 W 1.05 MOhm 1%; Manufacturer Name: Vishay; Manufacturer Part Number: CRCW04021M05FKED
SW1 = Switch - Push Button: Switch Tactile N.O. SPST Flush Round Button Gull Wing 0.05A 12VDC 200000Cycles 2.45N SMD T/R; Current Rating: 50 mA; Contact Form: SPST; Product Type: Tactile Switches; RoHS: Yes; Voltage Rating: 12 VDC; Case: SMD; Manufacturer Part Number: PTS526SK08SMTR2LFS
U6 = IC - AtMega2560V-8AU: ATmega Series 256 KB Flash 8 KB SRAM 8 MHz 8-Bit Microcontroller - TQFP-100; Program Memory Size: 256 kB; Core: AVR; Operating Supply Voltage: 2.7 V to 5.5 V; Maximum Clock Frequency: 8 MHz; Maximum Operating Temperature: + 85 C; Product Type: MicroControllers; Minimum Operating Temperature: - 40 C; Manufacturer Part Number: ATMEGA2560V-8AU
X1 = Crystal - 7.3728MHz: CRYSTAL 7.3728MHZ 18PF SMD; ESR: 150 Ohms; Product Type: Crystals; Minimum Operating Temperature: - 20 C; Maximum Operating Temperature: + 70 C; Load Capacitance: 18 pF; RoHS: Yes; Case: SMD; Manufacturer Part Number: ABMM2-7.3728MHZ-E2-T

## Sheet UnUsed MicroController Pins.SchDoc: UnUsed MicroController Pins
size 292 x 193 mm; SheetNumber: 20; SheetTotal: 28
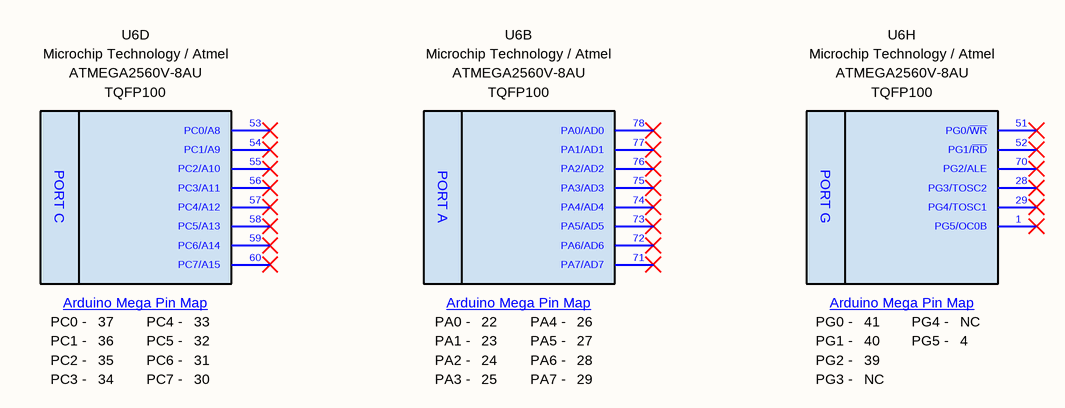
[diagram p21: UnUsed MicroController Pins.SchDoc]

### Parts
U6  Manufacturer Name: Microchip Technology / Atmel  Case: TQFP100  [TQFP-100]  (hidden comment: ATMEGA2560V-8AU)  (parts B,D,H of 16)

### Nets

Not connected (* = marked no-connect by the designer): U6 1(PG5/OC0B)* 28(PG3/TOSC2)* 29(PG4/TOSC1)* 51(PG0/~{WR})* 52(PG1/~{RD})* 53(PC0/A8)* 54(PC1/A9)* 55(PC2/A10)* 56(PC3/A11)* 57(PC4/A12)* 58(PC5/A13)* 59(PC6/A14)* 60(PC7/A15)* 70(PG2/ALE)* 71(PA7/AD7)* 72(PA6/AD6)* 73(PA5/AD5)* 74(PA4/AD4)* 75(PA3/AD3)* 76(PA2/AD2)* 77(PA1/AD1)* 78(PA0/AD0)*

### Notes on the sheet
- © 2021 All rights reserved.
  This document may not, in whole or in part, be copied, photocopied, reproduced, translated or converted to any electronic or machine readable from without prior written permission of Mehmet Günce Akkoyun.
  Engineer contact : akkoyun@me.com
- Property of
- Engineer :
- Date :
- Size :
- A4
- Time :
- Project :
- Page :
- /
- Customer :
- Product ID :
- Module ID :
- Version :
- File :
- Revision :
- (in symbol IC - AtMega2560V-8AU, part B) PORT A; Arduino Mega Pin Map; PA0 -; PA4 -; PA1 -; PA5 -; PA2 -; PA6 -; PA3 -; PA7 -
- (in symbol IC - AtMega2560V-8AU, part D) PORT C; Arduino Mega Pin Map; PC0 -; PC4 -; PC1 -; PC5 -; PC2 -; PC6 -; PC3 -; PC7 -
- (in symbol IC - AtMega2560V-8AU, part H) PORT G; Arduino Mega Pin Map; PG0 -; PG4 -; NC; PG1 -; PG5 -; PG2 -; PG3 -

### Library data of the parts
U6 = IC - AtMega2560V-8AU: as U6 on sheet Master Micro Controller Core; Maximum Operating Temperature: + 85 C; Product Type: MicroControllers; Minimum Operating Temperature: - 40 C; Manufacturer Part Number: ATMEGA2560V-8AU

## Sheet USB Connector.SchDoc: USB Type C Connector
size 393 x 292 mm; DocumentNumber: 29; SheetNumber: 17; SheetTotal: 28
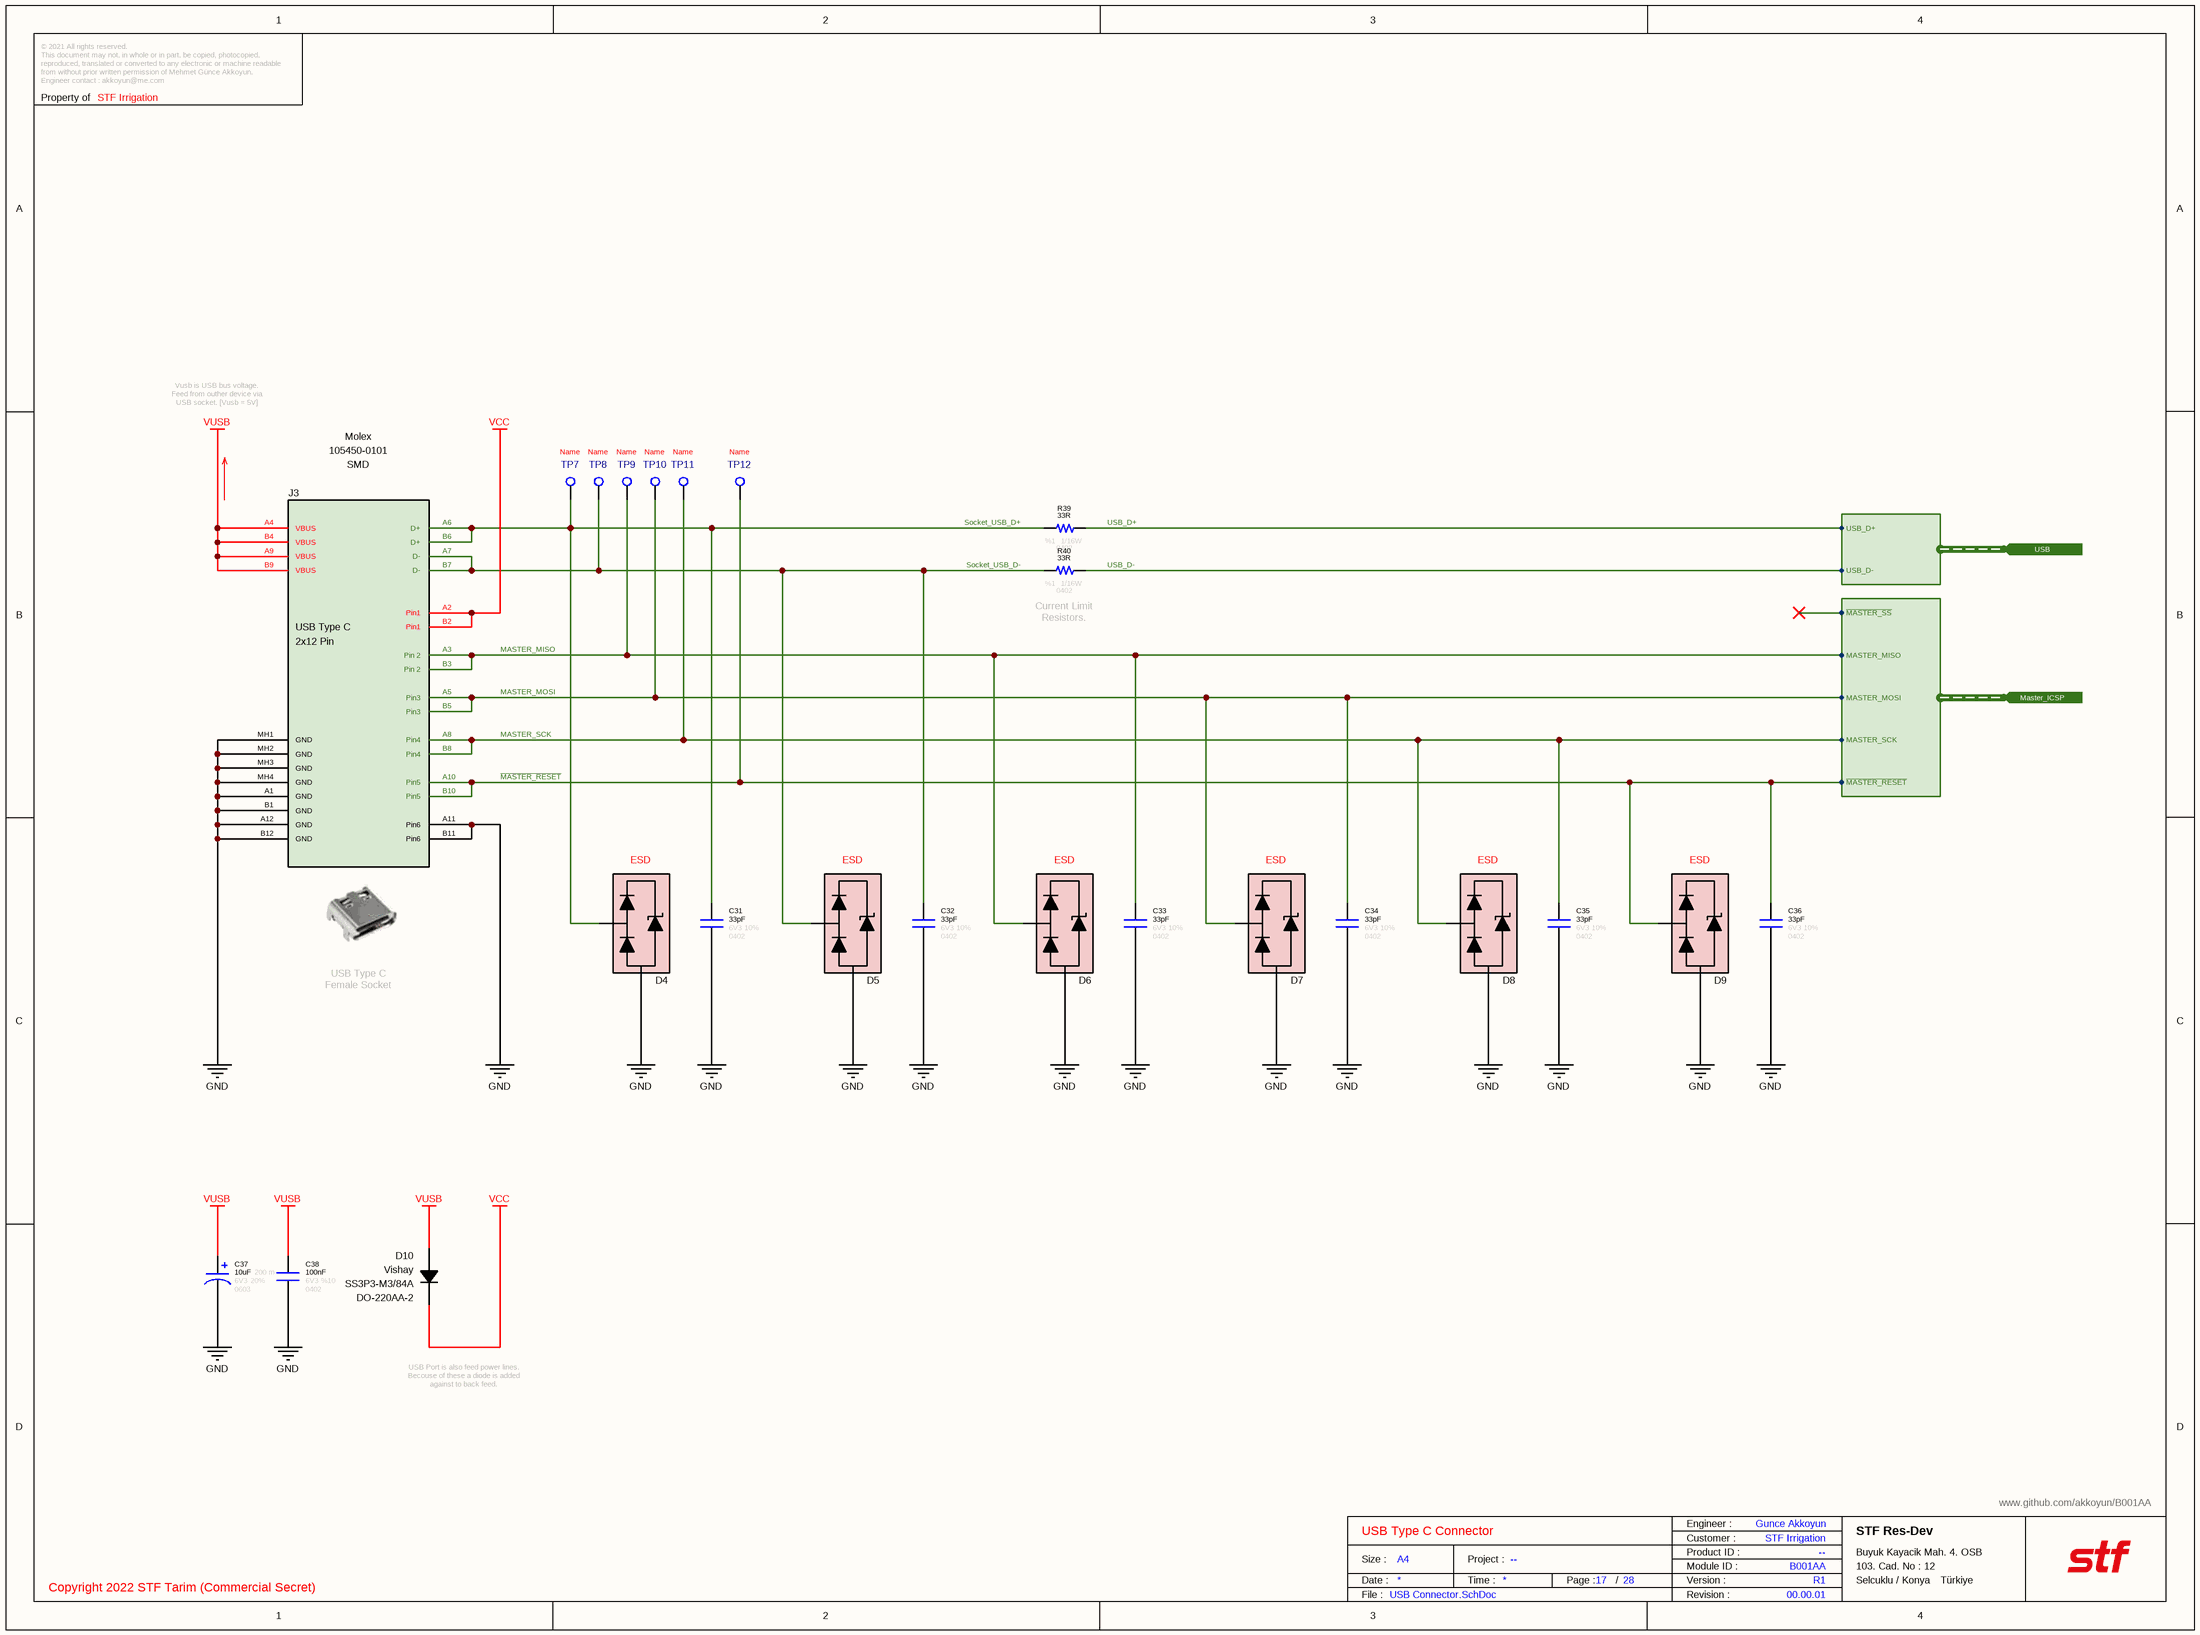
[diagram p22: USB Connector.SchDoc]

### Parts
C31  value 33pF  Tolerance: 10%  Case: 0402  Voltage: 6V3  [CAPACITOR_0402]  (hidden comment: Capacitor - 33pF [0402] (Ceramic))
C32  value 33pF  Tolerance: 10%  Case: 0402  Voltage: 6V3  [CAPACITOR_0402]  (hidden comment: Capacitor - 33pF [0402] (Ceramic))
C33  value 33pF  Tolerance: 10%  Case: 0402  Voltage: 6V3  [CAPACITOR_0402]  (hidden comment: Capacitor - 33pF [0402] (Ceramic))
C34  value 33pF  Tolerance: 10%  Case: 0402  Voltage: 6V3  [CAPACITOR_0402]  (hidden comment: Capacitor - 33pF [0402] (Ceramic))
C35  value 33pF  Tolerance: 10%  Case: 0402  Voltage: 6V3  [CAPACITOR_0402]  (hidden comment: Capacitor - 33pF [0402] (Ceramic))
C36  value 33pF  Tolerance: 10%  Case: 0402  Voltage: 6V3  [CAPACITOR_0402]  (hidden comment: Capacitor - 33pF [0402] (Ceramic))
C37  value 10uF  ESR: 200 m  Tolerance: 20%  Case: 0603  Voltage: 6V3  [CAPACITOR_0603_Tantalum]  (hidden comment: Capacitor - 10uF [0603] (Tantalum))
C38  value 100nF  Tolerance: %10  Voltage: 6V3  Case: 0402  [CAPACITOR_0402]  (hidden comment: Capacitor - 100nF [0402] (Ceramic))
D4  0402ESDA-MLP1  [ESD_0402]  (value not drawn)
D5  0402ESDA-MLP1  [ESD_0402]  (value not drawn)
D6  0402ESDA-MLP1  [ESD_0402]  (value not drawn)
D7  0402ESDA-MLP1  [ESD_0402]  (value not drawn)
D8  0402ESDA-MLP1  [ESD_0402]  (value not drawn)
D9  0402ESDA-MLP1  [ESD_0402]  (value not drawn)
D10  Manufacturer Name: Vishay  [DO-220AA-2]  (hidden comment: SS3P3-M3/84A)
J3  Manufacturer Name: Molex  Case: SMD  [USB Type C - Molex 105450-0101]  (hidden comment: 105450-0101)
R39  value 33R  Case: 0402  Tolerance: %1  Power: 1/16W  [RESISTOR_0402]  (hidden comment: 33R - 0402 - %1 - 1/16W)
R40  value 33R  Case: 0402  Tolerance: %1  Power: 1/16W  [RESISTOR_0402]  (hidden comment: 33R - 0402 - %1 - 1/16W)
TP7  PCB - Test Point  [Test_Point]  (value not drawn)  (no BOM)
TP8  PCB - Test Point  [Test_Point]  (value not drawn)  (no BOM)
TP9  PCB - Test Point  [Test_Point]  (value not drawn)  (no BOM)
TP10  PCB - Test Point  [Test_Point]  (value not drawn)  (no BOM)
TP11  PCB - Test Point  [Test_Point]  (value not drawn)  (no BOM)
TP12  PCB - Test Point  [Test_Point]  (value not drawn)  (no BOM)

### Ports
Master_ICSP (in, harness Master_ICSP), USB (in, harness USB)

### Harnesses
Master_ICSP: MASTER_MOSI, MASTER_MISO, MASTER_SCK, ~{MASTER_RESET}, ~{MASTER_SS}
USB: USB_D+, USB_D-

### Nets
GND: C31.1 C32.1 C33.1 C34.1 C35.1 C36.1 C37.2 C38.1 D4.2(GND) D5.2(GND) D6.2(GND) D7.2(GND) D8.2(GND) D9.2(GND) J3.A1(GND) J3.A11(Pin6) J3.A12(GND) J3.B1(GND) J3.B11(Pin6) J3.B12(GND) J3.MH1(GND) J3.MH2(GND) J3.MH3(GND) J3.MH4(GND)
VCC: D10.2(Cathode) J3.A2(Pin1) J3.B2(Pin1)
VUSB: C37.1 C38.2 D10.1(Anode) J3.A4(VBUS) J3.A9(VBUS) J3.B4(VBUS) J3.B9(VBUS)
~{MASTER_RESET}: C36.2 D9.1(I/O) J3.A10(Pin5) J3.B10(Pin5) TP12.1 ; port Master_ICSP.~{MASTER_RESET}
MASTER_MISO: C33.2 D6.1(I/O) J3.A3(Pin_2) J3.B3(Pin_2) TP9.1 ; port Master_ICSP.MASTER_MISO
MASTER_MOSI: C34.2 D7.1(I/O) J3.A5(Pin3) J3.B5(Pin3) TP10.1 ; port Master_ICSP.MASTER_MOSI
MASTER_SCK: C35.2 D8.1(I/O) J3.A8(Pin4) J3.B8(Pin4) TP11.1 ; port Master_ICSP.MASTER_SCK
Socket_USB_D+: C31.2 D4.1(I/O) J3.A6(D+) J3.B6(D+) R39.2 TP7.1
Socket_USB_D-: C32.2 D5.1(I/O) J3.A7(D-) J3.B7(D-) R40.2 TP8.1
USB_D+: R39.1 ; port USB.USB_D+
USB_D-: R40.1 ; port USB.USB_D-

### Notes on the sheet
- Vusb is USB bus voltage. Feed from outher device via USB socket. [Vusb = 5V]
- (near R40) Current Limit Resistors.
- USB Type C
  Female Socket
- USB Port is also feed power lines. Becouse of these a diode is added against to back feed.
- © 2021 All rights reserved.
  This document may not, in whole or in part, be copied, photocopied, reproduced, translated or converted to any electronic or machine readable from without prior written permission of Mehmet Günce Akkoyun.
  Engineer contact : akkoyun@me.com
- Property of
- Engineer :
- Date :
- Size :
- A4
- Time :
- Project :
- Page :
- /
- Customer :
- Product ID :
- Module ID :
- Version :
- File :
- Revision :
- (in symbol Connector - USB Type C SMD Connector) USB Type C; 2x12 Pin
- (in symbol Diode - TPD1E05U06DPYR) ESD

### Library data of the parts
C31-C36 = Capacitor - 33pF [0402-6V3]: as C45 on sheet I2C Temperature Sensor; ComponentLink1Description: DataSheet; ComponentLink1URL: https://api.kemet.com/component-edge/download/datasheet/C0402C330J9RACAUTO.pdf; ComponentLink2Description: Mouser; ComponentLink2URL: https://www.mouser.com/Search/Refine.aspx?Keyword=80-C0402C330J9RAUTO
C37 = Capacitor - 10uF [0603-6V3] (Tantalium): Capacitor - 10uF [0603] (Tantalium); Manufacturer Name: AVX; Manufacturer Part Number: F380J106MMAAH3; ComponentLink1Description: DataSheet; ComponentLink1URL: https://www.mouser.com.tr/datasheet/2/40/f38-775706.pdf; ComponentLink2Description: Mouser; ComponentLink2URL: https://www.mouser.com.tr/ProductDetail/AVX/F380J106MMAAH3?qs=sGAEpiMZZMtZ1n0r9vR22fixilZl6Mr8zRKleESmvcDFwZ4LSyC6Pg%3D%3D
C38 = Capacitor - 100nF [0402-6V3]: as C44 on sheet I2C Temperature Sensor; ComponentLink1Description: Mouser; ComponentLink1URL: https://www.mouser.com.tr/ProductDetail/AVX/04026D104KAT4A?qs=sGAEpiMZZMs0AnBnWHyRQPg4iYkCw7IMED%2F4kpqgf7w%3D; ComponentLink2Description: DataSheet; ComponentLink2URL: https://www.mouser.com.tr/datasheet/2/40/cx5r-776519.pdf
D4-D9 = Diode - TPD1E05U06DPYR: SUPPRESSOR ESD 30VDC 0402 HFREE; Manufacturer Name: Eaton; Breakdown Voltage: 30V; Capacitance: 0.15pF; Manufacturer Part Number: 0402ESDA-MLP1; Case: 0402
D10 = Diode - SS3P3M384A: Schottky Diodes & Rectifiers 3.0 Amp 30 Volt 50 Amp IFSM; Forward Current: 3 A; Forward Voltage: 580 mV; Maximum Operating Temperature: + 150 C; Minimum Operating Temperature: - 55 C; Product Type: Schottky Diodes & Rectifiers; RoHS: Yes; Manufacturer Part Number: SS3P3-M3/84A; Case: DO-220AA-2
J3 = Connector - USB Type C SMD Connector: USB Shielded I/O Receptacle; Type C; Right Angle; Surface Mount; Gold over Nickel; Current Rating: 5 A.; Gender: Jack (Female); Number of Contacts: 24 Contact; Voltage Rating: 30 V; Maximum Operating Temperature: + 85 C; Minimum Operating Temperature: - 30 C; Mounting Angle: Right Angle; Product Type: USB Connectors; RoHS: Yes; Manufacturer Part Number: 105450-0101
R39 R40 = Resistor - 33R [0402]: Thick Film Resistors - SMD 1/16 W 33 Ohm 1%; Manufacturer Name: Vishay; Manufacturer Part Number: CRCW040233R0FKED; ComponentLink1Description: DataSheet; ComponentLink1URL: https://www.mouser.com.tr/datasheet/2/427/dcrcwe3-1762152.pdf; ComponentLink2Description: Mouser; ComponentLink2URL: https://www.mouser.com.tr/ProductDetail/Vishay-Dale/CRCW0402330RFKED?qs=sGAEpiMZZMu61qfTUdNhG2DpbjADlD3GGS6SwBlLi5Q%3D
TP7-TP12 = PCB - Test Point: Test Point; Name: Name

## Sheet Serial to USB Converter.SchDoc: Serial to USB Converter
size 292 x 193 mm; DocumentNumber: 29; SheetNumber: 16; SheetTotal: 28
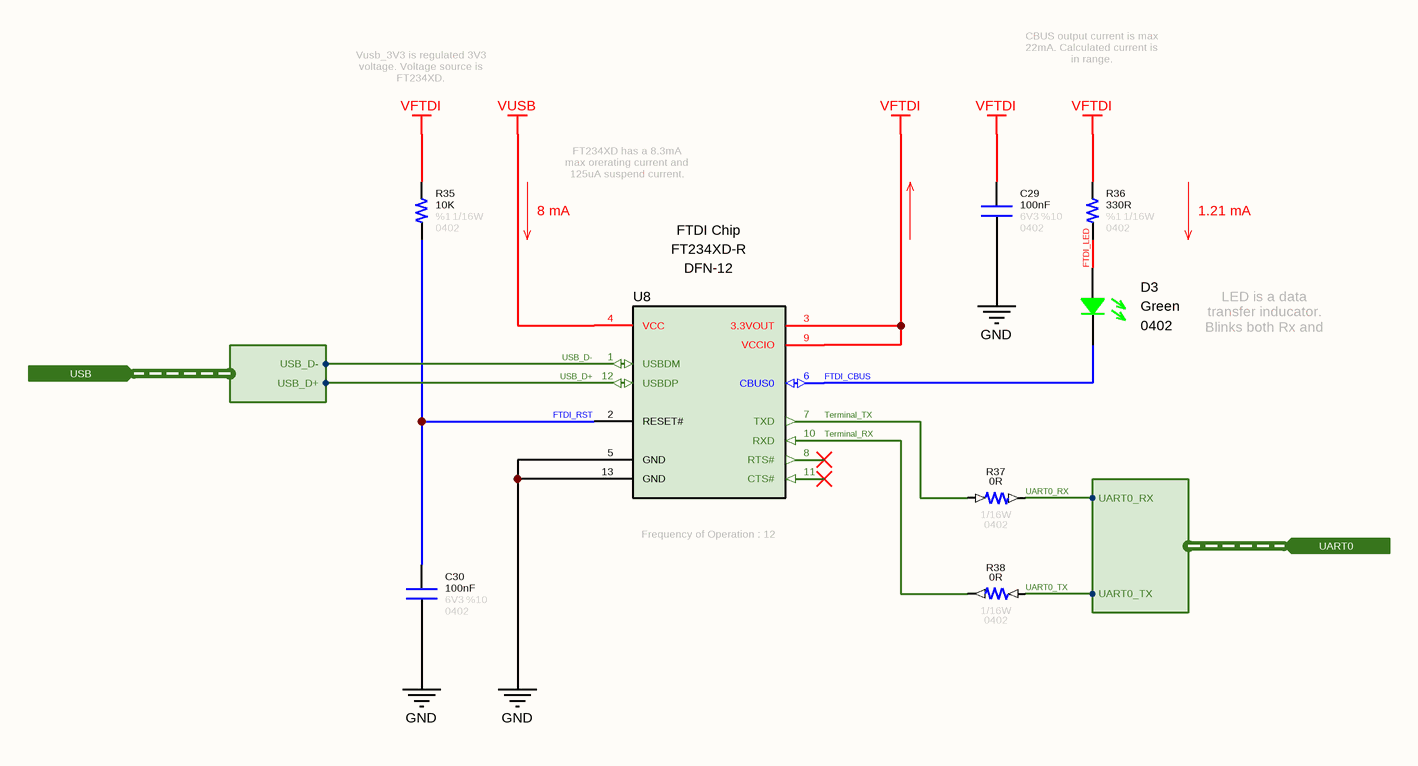
[diagram p23: Serial to USB Converter.SchDoc]

### Parts
C29  value 100nF  Tolerance: %10  Voltage: 6V3  Case: 0402  [CAPACITOR_0402]  (hidden comment: Capacitor - 100nF [0402] (Ceramic))
C30  value 100nF  Tolerance: %10  Voltage: 6V3  Case: 0402  [CAPACITOR_0402]  (hidden comment: Capacitor - 100nF [0402] (Ceramic))
D3  Case: 0402  Color: Green  [LED_0402]  (hidden comment: SMD LED (Green))
R35  value 10K  Tolerance: %1  Case: 0402  Power: 1/16W  [RESISTOR_0402]  (hidden comment: 10K - 0402 - %1 - 1/16W)
R36  value 330R  Case: 0402  Tolerance: %1  Power: 1/16W  [RESISTOR_0402]  (hidden comment: 330R - 0402 - %1 - 1/16W)
R37  value 0R  Case: 0402  Power: 1/16W  [RESISTOR_0402]  (hidden comment: 0R - 0402 - %1 - 1/16W)
R38  value 0R  Case: 0402  Power: 1/16W  [RESISTOR_0402]  (hidden comment: 0R - 0402 - %1 - 1/16W)
U8  Manufacturer Name: FTDI Chip  Case: DFN-12  [FT234XD-R]  (hidden comment: FT234XD-R)

### Ports
UART0 (in, harness UART0), USB (in, harness USB)

### Harnesses
USB: USB_D+, USB_D-
UART0: UART0_RX, UART0_TX

### Nets
GND: C29.1 C30.1 U8.5(GND) U8.13(GND)
VFTDI: C29.2 R35.2 R36.2 U8.3(3.3VOUT) U8.9(VCCIO)
VUSB: U8.4(VCC)
FTDI_CBUS: D3.1 U8.6(CBUS0)
FTDI_LED: D3.2 R36.1
FTDI_RST: C30.2 R35.1 U8.2(RESET#)
Terminal_RX: R38.2 U8.10(RXD)
Terminal_TX: R37.2 U8.7(TXD)
UART0_RX: R37.1 ; port UART0.UART0_RX
UART0_TX: R38.1 ; port UART0.UART0_TX
USB_D+: U8.12(USBDP) ; port USB.USB_D+
USB_D-: U8.1(USBDM) ; port USB.USB_D-

Not connected (* = marked no-connect by the designer): U8 8(RTS#)* 11(CTS#)*

### Notes on the sheet
- CBUS output current is max 22mA. Calculated current is in range.
- Vusb_3V3 is regulated 3V3 voltage. Voltage source is FT234XD.
- 8 mA
- FT234XD has a 8.3mA max orerating current and 125uA suspend current.
- 1.21 mA
- LED is a data transfer inducator. Blinks both Rx and Tx.
- (near U8) Frequency of Operation : 12 MHz
- © 2021 All rights reserved.
  This document may not, in whole or in part, be copied, photocopied, reproduced, translated or converted to any electronic or machine readable from without prior written permission of Mehmet Günce Akkoyun.
  Engineer contact : akkoyun@me.com
- Property of
- Engineer :
- Date :
- Size :
- A4
- Time :
- Project :
- Page :
- /
- Customer :
- Product ID :
- Module ID :
- Version :
- File :
- Revision :

### Library data of the parts
C29 C30 = Capacitor - 100nF [0402-6V3]: as C44 on sheet I2C Temperature Sensor; ComponentLink1Description: Mouser; ComponentLink1URL: https://www.mouser.com.tr/ProductDetail/AVX/04026D104KAT4A?qs=sGAEpiMZZMs0AnBnWHyRQPg4iYkCw7IMED%2F4kpqgf7w%3D; ComponentLink2Description: DataSheet; ComponentLink2URL: https://www.mouser.com.tr/datasheet/2/40/cx5r-776519.pdf
D3 = Diode - LED (0402-Green): Standard LEDs - SMD MINI-MOLD ULTRA COMPACT GREEN; Manufacturer Name: ROHM Semiconductor; Manufacturer Part Number: SML-P12MTT86R; ROHS: Yes; ComponentLink1Description: DataSheet; ComponentLink1URL: https://www.mouser.com.tr/datasheet/2/348/sml-p1-e-1139198.pdf; ComponentLink2Description: Mouser; ComponentLink2URL: https://www.mouser.com.tr/ProductDetail/ROHM-Semiconductor/SML-P12U2TT86R?qs=sGAEpiMZZMseGfSY3csMkRIBDsfU3UCXJTULB5gem9Ta%252Bp%252BvZ709fg%3D%3D
R35 = Resistor - 10K [0402]: as R55 on sheet I2C Temperature Sensor; ComponentLink1Description: DataSheet; ComponentLink1URL: https://www.mouser.com.tr/datasheet/2/427/dcrcwe3-1762152.pdf; ComponentLink2Description: Mouser; ComponentLink2URL: https://www.mouser.com.tr/ProductDetail/Vishay-Dale/CRCW040210K0FKED?qs=sGAEpiMZZMu61qfTUdNhG2DpbjADlD3GcalbOv9utCY%3D
R36 = Resistor - 330R [0402]: Thick Film Resistors - SMD 1/16 W 330 Ohm 1%; Manufacturer Name: Vishay; Manufacturer Part Number: CRCW0402330RFKED; ComponentLink1Description: DataSheet; ComponentLink1URL: https://www.mouser.com.tr/datasheet/2/427/dcrcwe3-1762152.pdf; ComponentLink2Description: Mouser; ComponentLink2URL: https://www.mouser.com.tr/ProductDetail/Vishay-Dale/CRCW0402330RFKED?qs=sGAEpiMZZMu61qfTUdNhG2DpbjADlD3GGS6SwBlLi5Q%3D
R37 R38 = Resistor - 0R [0402]: Thick Film Resistors - SMD 1/16 W 0 Ohm; Manufacturer Name: Vishay; Manufacturer Part Number: CRCW04020000Z0ED; ComponentLink1Description: DataSheet; ComponentLink1URL: https://www.mouser.com.tr/datasheet/2/427/dcrcwe3-1762152.pdf; ComponentLink2Description: Mouser; ComponentLink2URL: https://www.mouser.com.tr/ProductDetail/Vishay-Dale/CRCW04020000Z0ED?qs=sGAEpiMZZMu61qfTUdNhG2DpbjADlD3GG34cJb50zyg%3D
U8 = IC - FT234XD-R: USB Interface IC USB to Serial UART Interface; Data Rate: 12 Mb/s; Interface Type: UART, USB; Number of Ports: 1 Port; Maximum Operating Temperature: + 85 C; Minimum Operating Temperature: - 40 C; Product Type: USB Interface IC; RoHS: Yes; Manufacturer Part Number: FT234XD-R

## Sheet SD Card Block.SchDoc: SD Card Block
size 292 x 193 mm; SheetNumber: 26; SheetTotal: 28
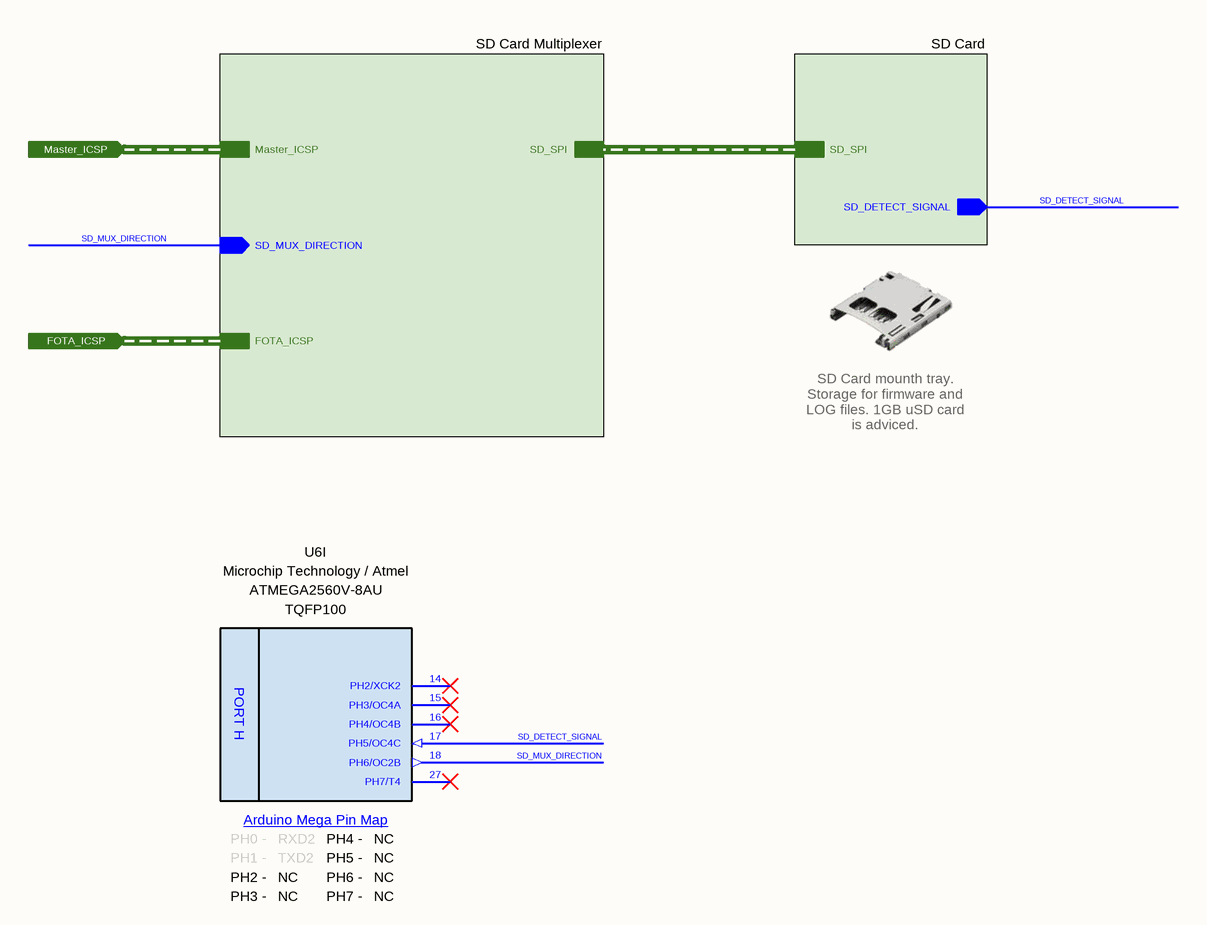
[diagram p24: SD Card Block.SchDoc]

### Parts
U6  Manufacturer Name: Microchip Technology / Atmel  Case: TQFP100  [TQFP-100]  (hidden comment: ATMEGA2560V-8AU)  (part I of 16)

### Sub-sheets
SD Card = SD Card.SchDoc: SD_SPI (harness SD_SPI), SD_DETECT_SIGNAL (out)
SD Card Multiplexer = SD Card Multiplexer.SchDoc: Master_ICSP (harness Master_ICSP), FOTA_ICSP (harness FOTA_ICSP), SD_SPI (harness SD_SPI), SD_MUX_DIRECTION (in)

### Ports
FOTA_ICSP (in, harness FOTA_ICSP), Master_ICSP (in, harness Master_ICSP)

### Nets
SD_DETECT_SIGNAL: U6.17(PH5/OC4C) ; sheet SD Card/SD_DETECT_SIGNAL
SD_MUX_DIRECTION: U6.18(PH6/OC2B) ; sheet SD Card Multiplexer/SD_MUX_DIRECTION

Not connected (* = marked no-connect by the designer): U6 14(PH2/XCK2)* 15(PH3/OC4A)* 16(PH4/OC4B)* 27(PH7/T4)*

### Buses and harness runs
harness port FOTA_ICSP = sheet SD Card Multiplexer/FOTA_ICSP
harness port Master_ICSP = sheet SD Card Multiplexer/Master_ICSP
harness sheet SD Card Multiplexer/SD_SPI = sheet SD Card/SD_SPI

### Notes on the sheet
- SD Card mounth tray. Storage for firmware and LOG files. 1GB uSD card is adviced.
- © 2021 All rights reserved.
  This document may not, in whole or in part, be copied, photocopied, reproduced, translated or converted to any electronic or machine readable from without prior written permission of Mehmet Günce Akkoyun.
  Engineer contact : akkoyun@me.com
- Property of
- Engineer :
- Date :
- Size :
- A4
- Time :
- Project :
- Page :
- /
- Customer :
- Product ID :
- Module ID :
- Version :
- File :
- Revision :
- (in symbol IC - AtMega2560V-8AU, part I) PORT H; Arduino Mega Pin Map; PH0 -; PH4 -; NC; PH1 -; PH5 -; PH2 -; PH6 -; PH3 -; PH7 -

### Library data of the parts
U6 = IC - AtMega2560V-8AU: as U6 on sheet Master Micro Controller Core; Maximum Operating Temperature: + 85 C; Product Type: MicroControllers; Minimum Operating Temperature: - 40 C; Manufacturer Part Number: ATMEGA2560V-8AU